# Altium project M8 Minima.PrjPcb (part 2 of 3)

## Sheet 04-2 m8 io 1.SchDoc
size A3; SheetNumber: 6; SheetTotal: 16
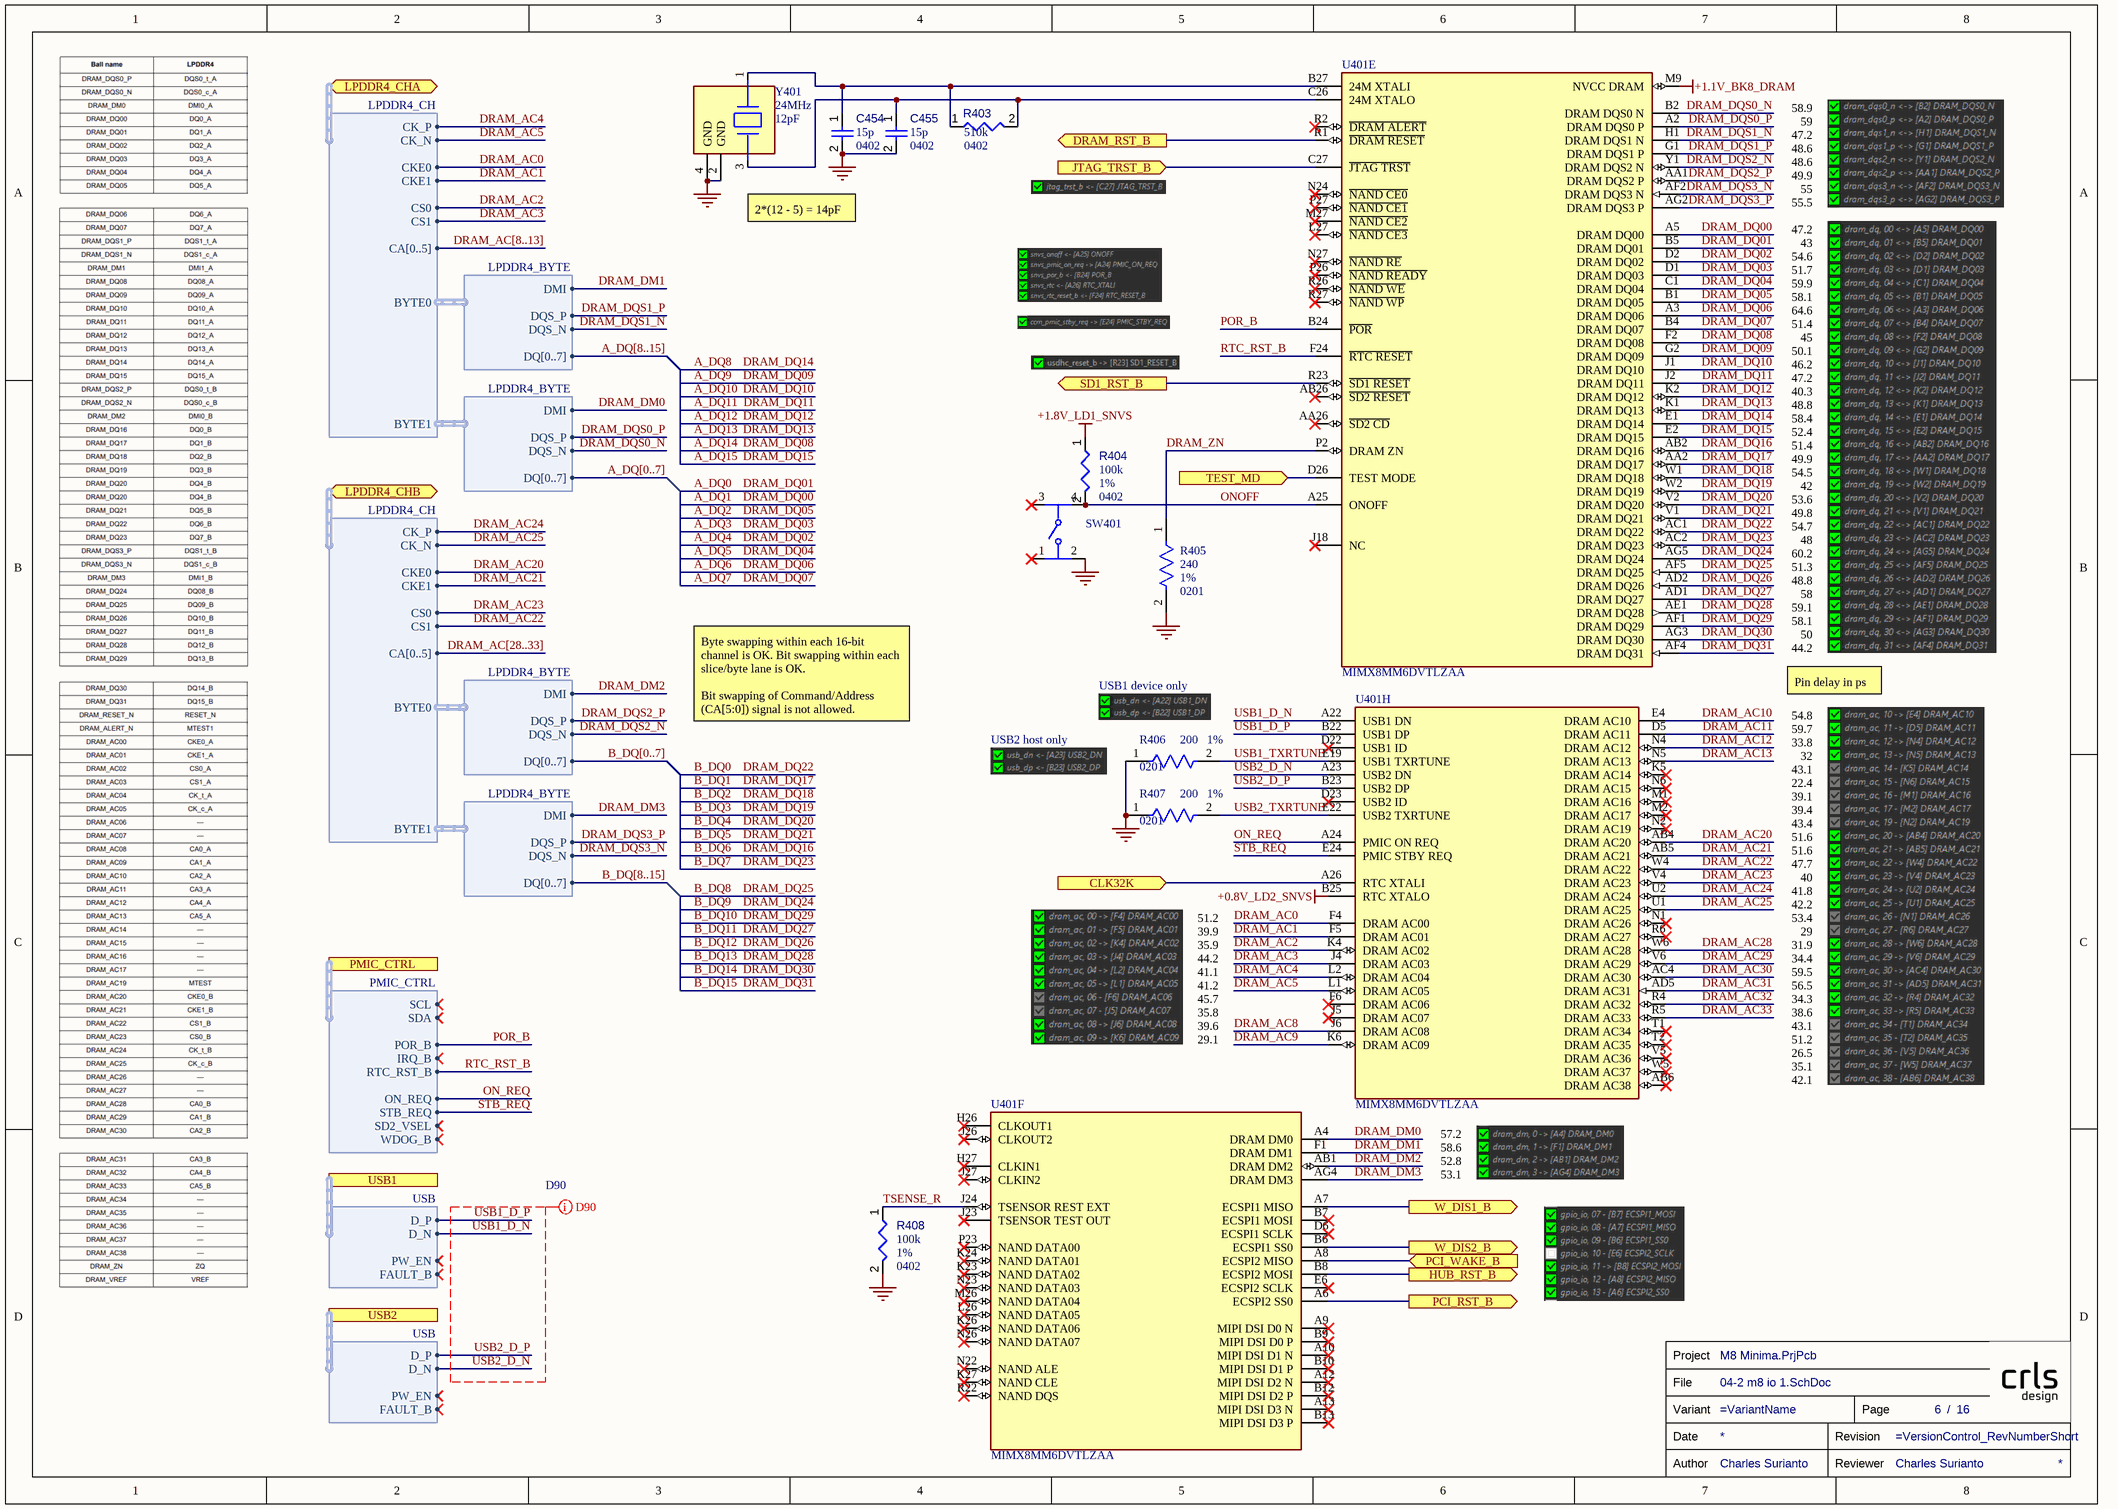
[diagram p4: 04-2 m8 io 1.SchDoc]

### Parts
(Parts that share a designator on the sheet are numbered #1, #2 ... from top to bottom, then left to right.)
C454  value 15p  Case/Package: 0402  [CAPC0402(1005)60_L]  (hidden comment: Capacitors,0402,15p)
C455  value 15p  Case/Package: 0402  [CAPC0402(1005)60_L]  (hidden comment: Capacitors,0402,15p)
R403  value 510k  Case/Package: 0402  [RESC0402(1005)_L]  (hidden comment: Resistors,0402,1%,510k)
R404  value 100k  Case/Package: 0402  Tolerance: 1%  [RESC0402(1005)_L]  (hidden comment: Resistors,0402,1%,100k)
R405  Tolerance: 1%  Case/Package: 0201  Resistance: 240  [FP-RMCF0201-MFG]  (hidden comment: RMCF0201FG240R)
R406  value 200  Tolerance: 1%  Case: 0201  [FP-ERJ1GN-MFG]  (hidden comment: ERJ-1GNF2000C)
R407  value 200  Tolerance: 1%  Case: 0201  [FP-ERJ1GN-MFG]  (hidden comment: ERJ-1GNF2000C)
R408  value 100k  Case/Package: 0402  Tolerance: 1%  [RESC0402(1005)_L]  (hidden comment: Resistors,0402,1%,100k)
SW401  PTS810SJM250SMTRLFS  [FP-PTS810SJM250SMTRLFS-MFG]  (value not drawn)
TB?#4  Reviewer: Charles Surianto  (hidden comment: TITLE_BLOCK)  (graphical)
U401  MIMX8MM6DVTLZAA  [FP-SOT1967-2-IPC_A]  (parts E,F,H of 11)
Y401  Load Capacitance: 12pF  Frequency: 24MHz  [FP-TSX-3225-MFG]  (hidden comment: TSX-3225 24.0000MF20G-AC3)

### Ports
CLK32K (in), DRAM_RST_B (out), HUB_RST_B (out), JTAG_TRST_B (in), LPDDR4_CHA (bidir, harness LPDDR4_CH), LPDDR4_CHB (bidir, harness LPDDR4_CH), PCI_RST_B (out), PCI_WAKE_B (in), PMIC_CTRL (harness PMIC_CTRL), SD1_RST_B (out), TEST_MD (in), USB1 (harness USB), USB2 (harness USB), W_DIS1_B (out), W_DIS2_B (out)

### Harnesses
LPDDR4_CH: CK_P, CK_N, CKE0, CKE1, CA[0..5], CS1, CS0, BYTE0, BYTE1
LPDDR4_BYTE: DMI, DQS_P, DQS_N, DQ[0..7]
PMIC_CTRL: SCL, SDA, IRQ_B, POR_B, RTC_RST_B, ON_REQ, STB_REQ, SD2_VSEL, WDOG_B
USB: PW_EN, FAULT_B, D_P, D_N

### Nets
+0.8V_LD2_SNVS: U401.B25(RTC_XTALO)
+1.1V_BK8_DRAM: U401.M9(NVCC_DRAM)
+1.8V_LD1_SNVS: R404.1
GND: C454.2 C455.2 R405.2 R406.1 R407.1 R408.2 SW401.2 Y401.2(GND) Y401.4(GND)
A_DQ0: U401.B5(DRAM_DQ01)  [also labelled DRAM_DQ01]
A_DQ1: U401.A5(DRAM_DQ00)  [also labelled DRAM_DQ00]
A_DQ2: U401.B1(DRAM_DQ05)  [also labelled DRAM_DQ05]
A_DQ3: U401.D1(DRAM_DQ03)  [also labelled DRAM_DQ03]
A_DQ4: U401.D2(DRAM_DQ02)  [also labelled DRAM_DQ02]
A_DQ5: U401.C1(DRAM_DQ04)  [also labelled DRAM_DQ04]
A_DQ6: U401.A3(DRAM_DQ06)  [also labelled DRAM_DQ06]
A_DQ7: U401.B4(DRAM_DQ07)  [also labelled DRAM_DQ07]
A_DQ8: U401.E1(DRAM_DQ14)  [also labelled DRAM_DQ14]
A_DQ9: U401.G2(DRAM_DQ09)  [also labelled DRAM_DQ09]
A_DQ10: U401.J1(DRAM_DQ10)  [also labelled DRAM_DQ10]
A_DQ11: U401.J2(DRAM_DQ11)  [also labelled DRAM_DQ11]
A_DQ12: U401.K2(DRAM_DQ12)  [also labelled DRAM_DQ12]
A_DQ13: U401.K1(DRAM_DQ13)  [also labelled DRAM_DQ13]
A_DQ14: U401.F2(DRAM_DQ08)  [also labelled DRAM_DQ08]
A_DQ15: U401.E2(DRAM_DQ15)  [also labelled DRAM_DQ15]
B_DQ0: U401.AC1(DRAM_DQ22)  [also labelled DRAM_DQ22]  [project net A_DQ0]
B_DQ1: U401.AA2(DRAM_DQ17)  [also labelled DRAM_DQ17]  [project net A_DQ1]
B_DQ2: U401.W1(DRAM_DQ18)  [also labelled DRAM_DQ18]  [project net A_DQ2]
B_DQ3: U401.W2(DRAM_DQ19)  [also labelled DRAM_DQ19]  [project net A_DQ3]
B_DQ4: U401.V2(DRAM_DQ20)  [also labelled DRAM_DQ20]  [project net A_DQ4]
B_DQ5: U401.V1(DRAM_DQ21)  [also labelled DRAM_DQ21]  [project net A_DQ5]
B_DQ6: U401.AB2(DRAM_DQ16)  [also labelled DRAM_DQ16]  [project net A_DQ6]
B_DQ7: U401.AC2(DRAM_DQ23)  [also labelled DRAM_DQ23]  [project net A_DQ7]
B_DQ8: U401.AF5(DRAM_DQ25)  [also labelled DRAM_DQ25]  [project net A_DQ8]
B_DQ9: U401.AG5(DRAM_DQ24)  [also labelled DRAM_DQ24]  [project net A_DQ9]
B_DQ10: U401.AF1(DRAM_DQ29)  [also labelled DRAM_DQ29]  [project net A_DQ10]
B_DQ11: U401.AD1(DRAM_DQ27)  [also labelled DRAM_DQ27]  [project net A_DQ11]
B_DQ12: U401.AD2(DRAM_DQ26)  [also labelled DRAM_DQ26]  [project net A_DQ12]
B_DQ13: U401.AE1(DRAM_DQ28)  [also labelled DRAM_DQ28]  [project net A_DQ13]
B_DQ14: U401.AG3(DRAM_DQ30)  [also labelled DRAM_DQ30]  [project net A_DQ14]
B_DQ15: U401.AF4(DRAM_DQ31)  [also labelled DRAM_DQ31]  [project net A_DQ15]
DRAM_AC0: U401.F4(DRAM_AC00) ; port LPDDR4_CHA.CKE0  [project net DRAM_CHA.CKE0]
DRAM_AC1: U401.F5(DRAM_AC01) ; port LPDDR4_CHA.CKE1  [project net DRAM_CHA.CKE1]
DRAM_AC2: U401.K4(DRAM_AC02) ; port LPDDR4_CHA.CS0  [project net DRAM_CHA.CS0]
DRAM_AC3: U401.J4(DRAM_AC03) ; port LPDDR4_CHA.CS1  [project net DRAM_CHA.CS1]
DRAM_AC4: U401.L2(DRAM_AC04) ; port LPDDR4_CHA.CK_P  [project net DRAM_CHA.CK_P]
DRAM_AC5: U401.L1(DRAM_AC05) ; port LPDDR4_CHA.CK_N  [project net DRAM_CHA.CK_N]
DRAM_AC8: U401.J6(DRAM_AC08)  [project net B_CA0]
DRAM_AC9: U401.K6(DRAM_AC09)  [project net B_CA1]
DRAM_AC10: U401.E4(DRAM_AC10)  [project net B_CA2]
DRAM_AC11: U401.D5(DRAM_AC11)  [project net B_CA3]
DRAM_AC12: U401.N4(DRAM_AC12)  [project net B_CA4]
DRAM_AC13: U401.N5(DRAM_AC13)  [project net B_CA5]
DRAM_AC20: U401.AB4(DRAM_AC20) ; port LPDDR4_CHB.CKE0  [project net DRAM_CHB.CKE0]
DRAM_AC21: U401.AB5(DRAM_AC21) ; port LPDDR4_CHB.CKE1  [project net DRAM_CHB.CKE1]
DRAM_AC22: U401.W4(DRAM_AC22) ; port LPDDR4_CHB.CS1  [project net DRAM_CHB.CS1]
DRAM_AC23: U401.V4(DRAM_AC23) ; port LPDDR4_CHB.CS0  [project net DRAM_CHB.CS0]
DRAM_AC24: U401.U2(DRAM_AC24) ; port LPDDR4_CHB.CK_P  [project net DRAM_CHB.CK_P]
DRAM_AC25: U401.U1(DRAM_AC25) ; port LPDDR4_CHB.CK_N  [project net DRAM_CHB.CK_N]
DRAM_AC28: U401.W6(DRAM_AC28)  [project net A_CA0]
DRAM_AC29: U401.V6(DRAM_AC29)  [project net A_CA1]
DRAM_AC30: U401.AC4(DRAM_AC30)  [project net A_CA2]
DRAM_AC31: U401.AD5(DRAM_AC31)  [project net A_CA3]
DRAM_AC32: U401.R4(DRAM_AC32)  [project net A_CA4]
DRAM_AC33: U401.R5(DRAM_AC33)  [project net A_CA5]
DRAM_DM0: U401.A4(DRAM_DM0) ; harness LPDDR4_BYTE.DMI  [project net B_DMI1]
DRAM_DM1: U401.F1(DRAM_DM1) ; harness LPDDR4_BYTE.DMI  [project net B_DMI0]
DRAM_DM2: U401.AB1(DRAM_DM2) ; harness LPDDR4_BYTE.DMI  [project net A_DMI0]
DRAM_DM3: U401.AG4(DRAM_DM3) ; harness LPDDR4_BYTE.DMI  [project net A_DMI1]
DRAM_DQS0_N: U401.B2(DRAM_DQS0_N) ; harness LPDDR4_BYTE.DQS_N  [project net B_DQS1_N]
DRAM_DQS0_P: U401.A2(DRAM_DQS0_P) ; harness LPDDR4_BYTE.DQS_P  [project net B_DQS1_P]
DRAM_DQS1_N: U401.H1(DRAM_DQS1_N) ; harness LPDDR4_BYTE.DQS_N  [project net B_DQS0_N]
DRAM_DQS1_P: U401.G1(DRAM_DQS1_P) ; harness LPDDR4_BYTE.DQS_P  [project net B_DQS0_P]
DRAM_DQS2_N: U401.Y1(DRAM_DQS2_N) ; harness LPDDR4_BYTE.DQS_N  [project net A_DQS0_N]
DRAM_DQS2_P: U401.AA1(DRAM_DQS2_P) ; harness LPDDR4_BYTE.DQS_P  [project net A_DQS0_P]
DRAM_DQS3_N: U401.AF2(DRAM_DQS3_N) ; harness LPDDR4_BYTE.DQS_N  [project net A_DQS1_N]
DRAM_DQS3_P: U401.AG2(DRAM_DQS3_P) ; harness LPDDR4_BYTE.DQS_P  [project net A_DQS1_P]
DRAM_RST_B: U401.R1(~{DRAM_RESET}) ; port DRAM_RST_B
DRAM_ZN: R405.1 U401.P2(DRAM_ZN)
HUB_RST_B: U401.B8(ECSPI2_MOSI) ; port HUB_RST_B
JTAG_TRST_B: U401.C27(~{JTAG_TRST}) ; port JTAG_TRST_B
ON_REQ: U401.A24(PMIC_ON_REQ) ; port PMIC_CTRL.ON_REQ  [project net PMIC_CTRL.ON_REQ]
ONOFF: R404.2 SW401.4 U401.A25(ONOFF)
PCI_RST_B: U401.A6(ECSPI2_SS0) ; port PCI_RST_B
PCI_WAKE_B: U401.A8(ECSPI2_MISO) ; port PCI_WAKE_B
PMIC_CLK32K: U401.A26(RTC_XTALI) ; port CLK32K
POR_B: U401.B24(~{POR}) ; port PMIC_CTRL.POR_B  [project net PMIC_CTRL.POR_B]
RTC_RST_B: U401.F24(~{RTC_RESET}) ; port PMIC_CTRL.RTC_RST_B  [project net PMIC_CTRL.RTC_RST_B]
SD1_RST_B: U401.R23(~{SD1_RESET}) ; port SD1_RST_B
STB_REQ: U401.E24(PMIC_STBY_REQ) ; port PMIC_CTRL.STB_REQ  [project net PMIC_CTRL.STB_REQ]
TEST_MD: U401.D26(TEST_MODE) ; port TEST_MD
TSENSE_R: R408.1 U401.J24(TSENSOR_REST_EXT)
USB1_D_N: U401.A22(USB1_DN) ; port USB1.D_N  [project net USB1.D_N]
USB1_D_P: U401.B22(USB1_DP) ; port USB1.D_P  [project net USB1.D_P]
USB1_TXRTUNE: R406.2 U401.E19(USB1_TXRTUNE)
USB2_D_N: U401.A23(USB2_DN) ; port USB2.D_N  [project net USB2.D_N]
USB2_D_P: U401.B23(USB2_DP) ; port USB2.D_P  [project net USB2.D_P]
USB2_TXRTUNE: R407.2 U401.E22(USB2_TXRTUNE)
W_DIS1_B: U401.A7(ECSPI1_MISO) ; port W_DIS1_B
W_DIS2_B: U401.B6(ECSPI1_SS0) ; port W_DIS2_B
NetC454_1: C454.1 R403.1 U401.B27(24M_XTALI) Y401.1
NetC455_1: C455.1 R403.2 U401.C26(24M_XTALO) Y401.3

Not connected (* = marked no-connect by the designer): SW401 1* 3*; U401 A9(MIPI_DSI_D0_N)* A10(MIPI_DSI_D1_N)* A12(MIPI_DSI_D2_N)* A13(MIPI_DSI_D3_N)* AA26(~{SD2_CD})* AB6(DRAM_AC38)* AB26(~{SD2_RESET})* B7(ECSPI1_MOSI)* B9(MIPI_DSI_D0_P)* B10(MIPI_DSI_D1_P)* B12(MIPI_DSI_D2_P)* B13(MIPI_DSI_D3_P)* D6(ECSPI1_SCLK)* D22(USB1_ID)* D23(USB2_ID)* E6(ECSPI2_SCLK)* F6(DRAM_AC06)* H26(CLKOUT1)* H27(CLKIN1)* J5(DRAM_AC07)* J18(NC)* J23(TSENSOR_TEST_OUT)* J26(CLKOUT2)* J27(CLKIN2)* K5(DRAM_AC14)* K23(NAND_DATA02)* K24(NAND_DATA01)* K26(NAND_DATA06)* K27(NAND_CLE)* L26(NAND_DATA05)* L27(~{NAND_CE3})* M1(DRAM_AC16)* M2(DRAM_AC17)* M26(NAND_DATA04)* M27(~{NAND_CE2})* N1(DRAM_AC26)* N2(DRAM_AC19)* N6(DRAM_AC15)* N22(NAND_ALE)* N23(NAND_DATA03)* N24(~{NAND_CE0})* N26(NAND_DATA07)* N27(~{NAND_RE})* P23(NAND_DATA00)* P26(~{NAND_READY})* P27(~{NAND_CE1})* R2(~{DRAM_ALERT})* R6(DRAM_AC27)* R22(NAND_DQS)* R26(~{NAND_WE})* R27(~{NAND_WP})* T1(DRAM_AC34)* T2(DRAM_AC35)* V5(DRAM_AC36)* W5(DRAM_AC37)*

### Buses and harness runs
bus A_DQ[0..7]
bus A_DQ[8..15]
bus B_DQ[0..7]
bus B_DQ[8..15]
bus DRAM_AC[8..13]
bus DRAM_AC[28..33]

### Layout directives
differential pair; differential pair class D90: USB1_D_N, USB1_D_P, USB2_D_N, USB2_D_P

### Notes on the sheet
- 2*(12 - 5) = 14pF
- 58.9
  59
  47.2
  48.6
  48.6
  49.9
  55
  55.5
- 47.2
  43
  54.6
  51.7
  59.9
  58.1
  64.6
  51.4
  45
  50.1
  46.2
  47.2
  40.3
  48.8
  58.4
  52.4
  51.4
  49.9
  54.5
  42
  53.6
  49.8
  54.7
  48
  60.2
  51.3
  48.8
  58
  59.1
  58.1
  50
  44.2
- Byte swapping within each 16-bit channel is OK. Bit swapping within each slice/byte lane is OK.
  Bit swapping of Command/Address (CA[5:0]) signal is not allowed.
- USB1 device only
- Pin delay in ps
- USB2 host only
- 51.2
  39.9
  35.9
  44.2
  41.1
  41.2
  45.7
  35.8
  39.6
  29.1
- 54.8
  59.7
  33.8
  32
  43.1
  22.4
  39.1
  39.4
  43.4
  51.6
  51.6
  47.7
  40
  41.8
  42.2
  53.4
  29
  31.9
  34.4
  59.5
  56.5
  34.3
  38.6
  43.1
  51.2
  26.5
  35.1
  42.1
- (near U401) 57.2
  58.6
  52.8
  53.1
- (in symbol TITLE_BLOCK) Project; File; Variant; Page; /; Date; Revision; Author; Reviewer

### Library data of the parts
C454 C455 = Capacitors: Capacitor; Component Type: Capacitors
R403 R404 R408 = Resistors: Resistor; Component Type: Resistors
  R403: Tolerance: 1%
R405 = CMP-26527-006303-1: 240Ω ±1% 0.05W 0201 Thick Film Chip Resistor AEC-Q200 compliant; Temperature Coefficient: 200ppm/°C; Max Power Dissipation: 50mW; Resistor Type: Thick Film; Case Code (Imperial): 0201; Case Code (Metric): 0603; Min Operating Temperature: -55°C; Length: 0.024inch; Packaging: Tape and Reel; Max Operating Temperature: 125°C; Number of Terminations: 2; Width: 0.012inch; Height: 0.009inch
R406 R407 = CMP-2004-03479-2: RES SMD 200 OHM 1% 1/20W 0201; Manufacturer: Panasonic Electronic Components; Power Rating: 0.05W; Automotive Grade: Grade 1; Temperature Coefficient: 200ppm/°C; Resistance: 200Ω; Voltage Rating: 25V; Height: 0.26mm; Mouser Description: Thick Film Resistors - SMD 0201 200ohm 1% HalogenFree AEC-Q200; Composition: Thick Film; Footprint Url: https://industrial.panasonic.com/cdbs/www-data/pdf/RDA0000/DMA0000COL17.pdf; Manufacturer Part Number: ERJ-1GNF2000C; Temperature Range High: +125°C; Automotive: Yes; Package: ERJ1GN; Octopart: https://octopart.com/erj-1gnf2000c-panasonic-55419768; Device Class L3: Chip SMD Resistors; Category: Res; ComponentLink2URL: https://industrial.panasonic.com/cdbs/www-data/pdf/RDA0000/AOA0000C304.pdf; Digikey Description: RES SMD 200 OHM 1% 1/20W 0201; Temperature: -55°C to +125°C; Temperature Range Low: -55°C; ComponentLink2Description: Datasheet; Series: ERJ; RoHS: TRUE; Lead Free: Yes; Device Class L2: Resistors; Device Class L1: Passive Components
SW401 = CMP-10040-000001-2: SWITCH TACTILE SPST-NO 0.05A 16V; Throw Configuration: SPST; Operating Force: 160gf; Actuator Type: Standard; Switch Travel: 0.15mm; Switch Function: Off-Mom; Max Current Rating: 50mA; Mechanical Life: 150000Cycles; Illumination Type: Non-Illuminated; Package Quantity: 2900; Depth: 4.6mm; Mount: Surface Mount; Packaging: Tape and Reel; Length: 3.2mm; RoHS Compliant: Yes; Case/Package: SMD/SMT; Voltage Rating (DC): 16V; Min Operating Temperature: -40°C; Termination: J-Bend; Lead Free: Lead Free; Contact Plating: Silver; Orientation: Straight; Max Operating Temperature: 85°C; Current Rating: 50mA; Color: Black
U401 = CMP-10096-000012-1: IC MPU I.MX 8M MINI QUAD BGA; RoHS Compliant: Yes
Y401 = CMP-36405-000018-1: CRYSTAL 24.0000MHZ 9PF SMD; ESR (Equivalent Series Resistance): 40R; Frequency Stability: 20ppm; Tolerance: 10ppm; Drive Level: 200uW; Min Operating Temperature: -40°C; RoHS Compliant: Yes; Width: 2.5mm; Max Operating Temperature: 105°C; Package Quantity: 250; Mount: Surface Mount; Lead Free: Lead Free; Height: 0.024inch; Depth: 2.5mm; Packaging: Tape and Reel; Series: TSX-3225; Weight: 0.000564oz; Number of Pins: 4; Termination: SMD/SMT; Case/Package: SMD/SMT; Length: 3.2mm; Frequency Tolerance: 10ppm
TB?#4 = TITLE_BLOCK: Review Date: *

## Sheet 04-4 m8 boot config.SchDoc
size A3; SheetNumber: 8; SheetTotal: 16
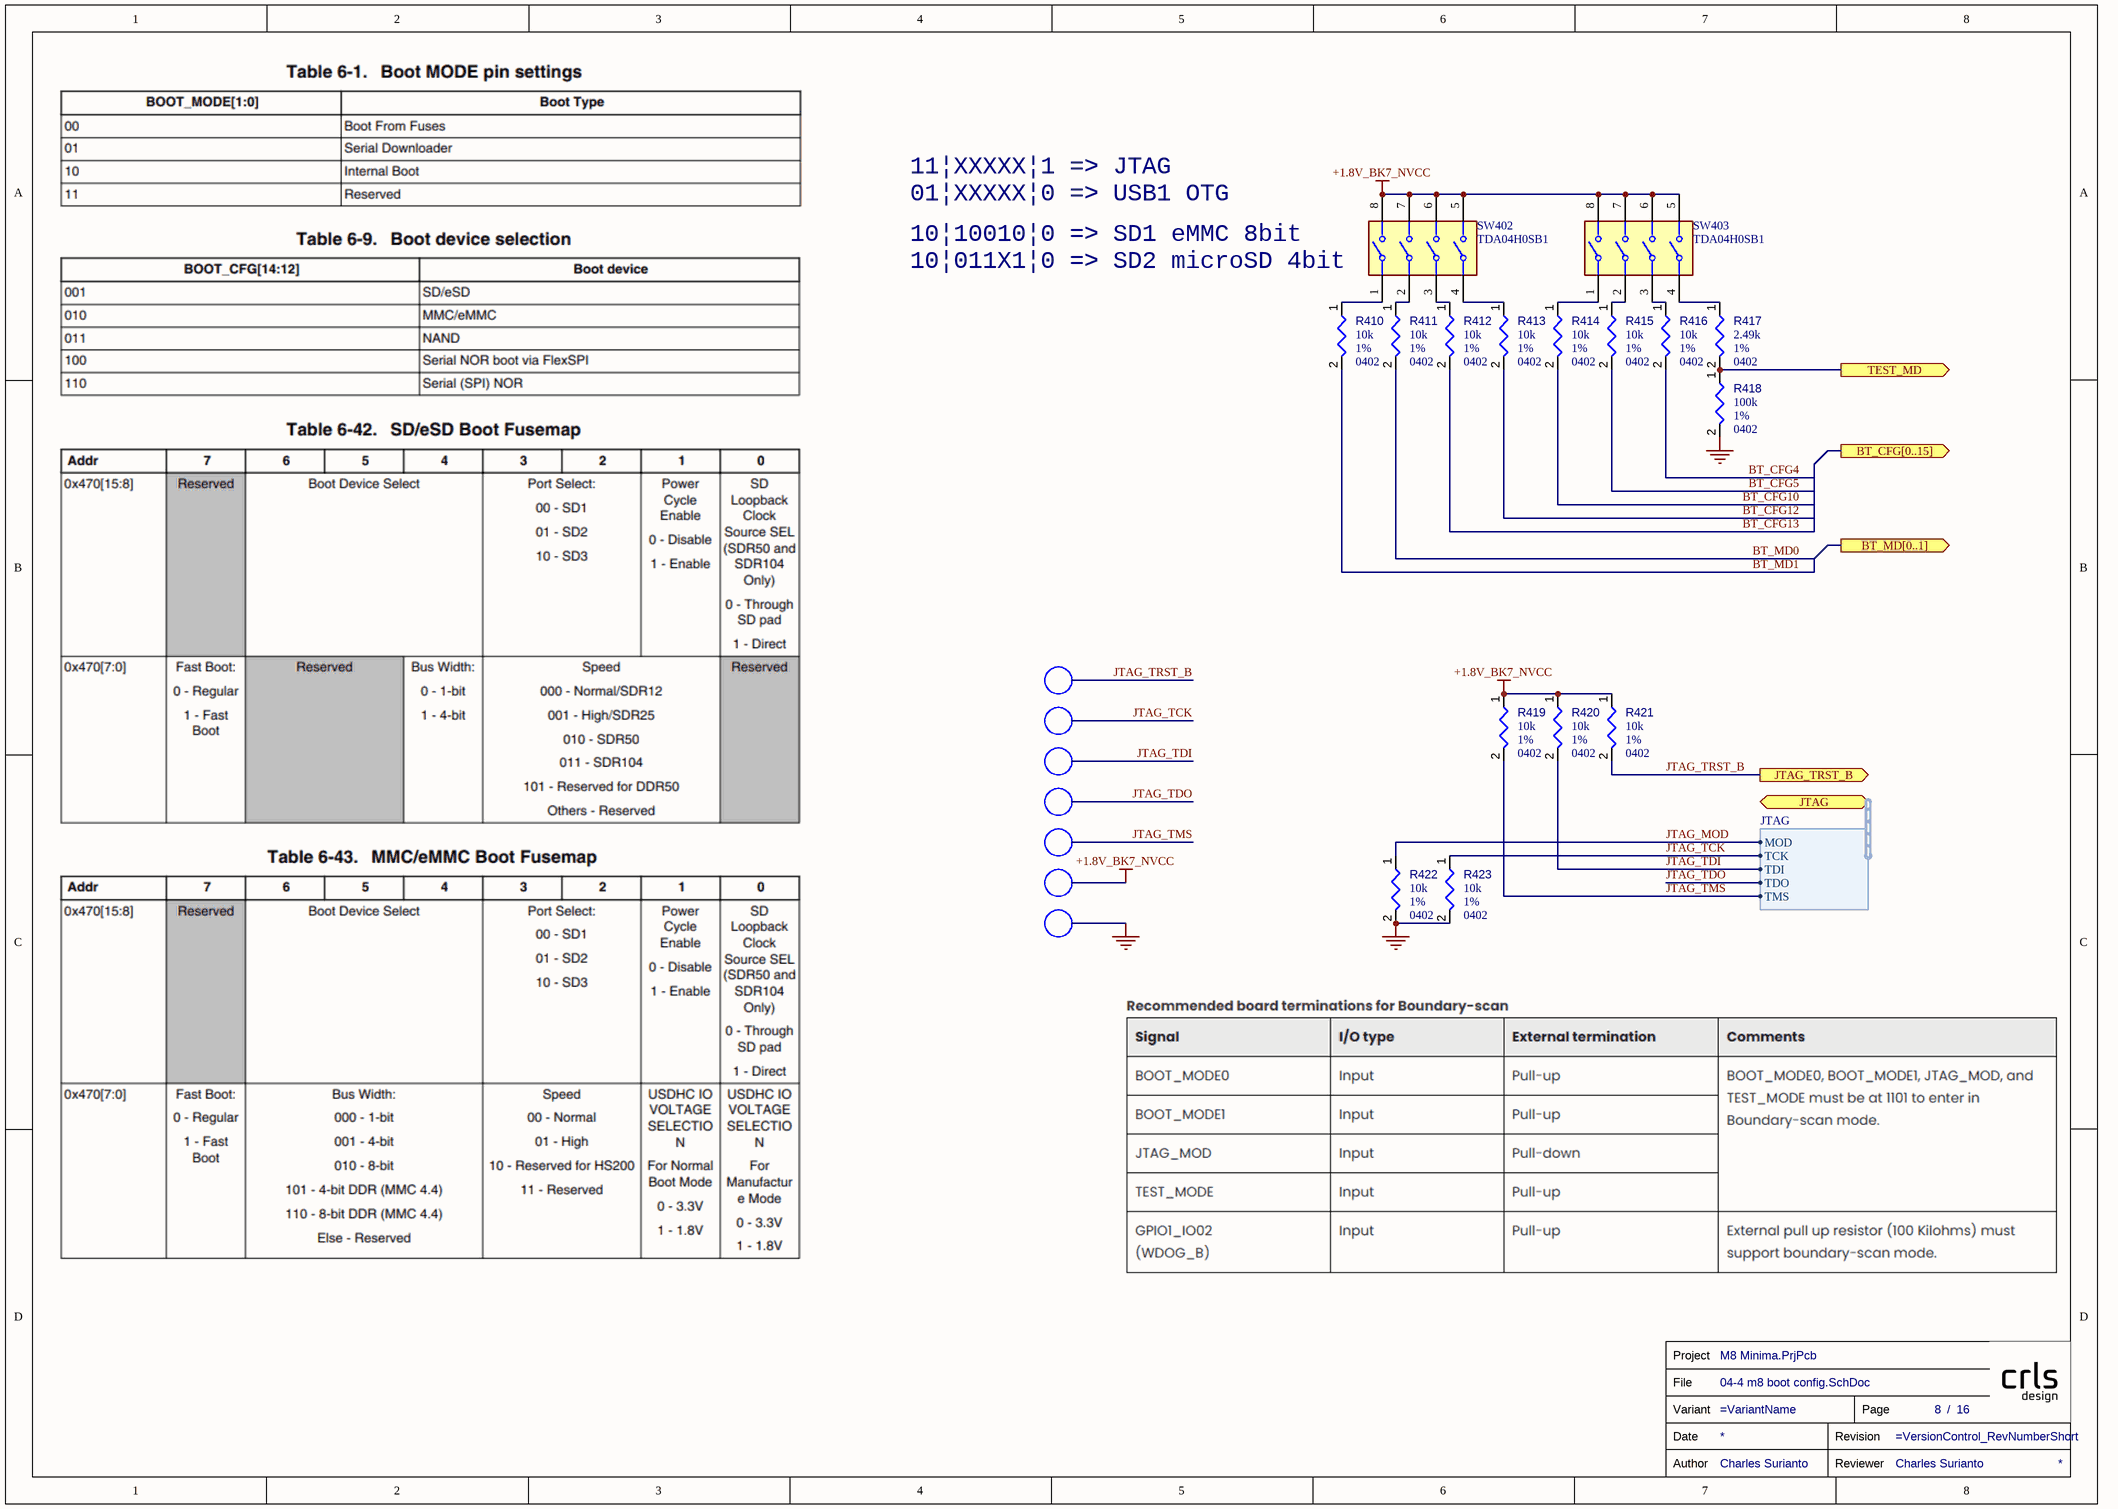
[diagram p5: 04-4 m8 boot config.SchDoc]

### Parts
(Parts that share a designator on the sheet are numbered #1, #2 ... from top to bottom, then left to right.)
R410  value 10k  Case/Package: 0402  Tolerance: 1%  [RESC0402(1005)_L]  (hidden comment: Resistors,0402,1%,10k)
R411  value 10k  Case/Package: 0402  Tolerance: 1%  [RESC0402(1005)_L]  (hidden comment: Resistors,0402,1%,10k)
R412  value 10k  Case/Package: 0402  Tolerance: 1%  [RESC0402(1005)_L]  (hidden comment: Resistors,0402,1%,10k)
R413  value 10k  Case/Package: 0402  Tolerance: 1%  [RESC0402(1005)_L]  (hidden comment: Resistors,0402,1%,10k)
R414  value 10k  Case/Package: 0402  Tolerance: 1%  [RESC0402(1005)_L]  (hidden comment: Resistors,0402,1%,10k)
R415  value 10k  Case/Package: 0402  Tolerance: 1%  [RESC0402(1005)_L]  (hidden comment: Resistors,0402,1%,10k)
R416  value 10k  Case/Package: 0402  Tolerance: 1%  [RESC0402(1005)_L]  (hidden comment: Resistors,0402,1%,10k)
R417  value 2.49k  Case/Package: 0402  Tolerance: 1%  [RESC0402(1005)_L]  (hidden comment: Resistors,0402,1%,2.49k)
R418  value 100k  Case/Package: 0402  Tolerance: 1%  [RESC0402(1005)_L]  (hidden comment: Resistors,0402,1%,100k)
R419  value 10k  Case/Package: 0402  Tolerance: 1%  [RESC0402(1005)_L]  (hidden comment: Resistors,0402,1%,10k)
R420  value 10k  Case/Package: 0402  Tolerance: 1%  [RESC0402(1005)_L]  (hidden comment: Resistors,0402,1%,10k)
R421  value 10k  Case/Package: 0402  Tolerance: 1%  [RESC0402(1005)_L]  (hidden comment: Resistors,0402,1%,10k)
R422  value 10k  Case/Package: 0402  Tolerance: 1%  [RESC0402(1005)_L]  (hidden comment: Resistors,0402,1%,10k)
R423  value 10k  Case/Package: 0402  Tolerance: 1%  [RESC0402(1005)_L]  (hidden comment: Resistors,0402,1%,10k)
SW402  TDA04H0SB1  [FP-TDA04H0SB1-MFG]
SW403  TDA04H0SB1  [FP-TDA04H0SB1-MFG]
TB?#5  Reviewer: Charles Surianto  (hidden comment: TITLE_BLOCK)  (graphical)

### Ports
BT_CFG[0..15] (out), BT_MD[0..1] (out), JTAG (bidir, harness JTAG), JTAG_TRST_B (out), TEST_MD (out)

### Harnesses
JTAG: MOD, TCK, TDI, TDO, TMS

### Nets
+1.8V_BK7_NVCC: R419.1 R420.1 R421.1 SW402.5 SW402.6 SW402.7 SW402.8 SW403.5 SW403.6 SW403.7 SW403.8
GND: R418.2 R422.2 R423.2
BT_CFG4: R416.2
BT_CFG5: R415.2
BT_CFG10: R414.2
BT_CFG12: R413.2
BT_CFG13: R412.2
BT_MD0: R411.2
BT_MD1: R410.2
JTAG_MOD: R422.1 ; port JTAG.MOD
JTAG_TCK: R423.1 ; port JTAG.TCK
JTAG_TDI: R420.2 ; port JTAG.TDI
JTAG_TMS: R419.2 ; port JTAG.TMS
JTAG_TRST_B: R421.2 ; port JTAG_TRST_B
TEST_MD: R417.2 R418.1 ; port TEST_MD
NetR410_1: R410.1 SW402.1
NetR411_1: R411.1 SW402.2
NetR412_1: R412.1 SW402.3
NetR413_1: R413.1 SW402.4
NetR414_1: R414.1 SW403.1
NetR415_1: R415.1 SW403.2
NetR416_1: R416.1 SW403.3
NetR417_1: R417.1 SW403.4

### Notes on the sheet
- 11|XXXXX|1 => JTAG
- 01|XXXXX|0 => USB1 OTG
- 10|10010|0 => SD1 eMMC 8bit
- 10|011X1|0 => SD2 microSD 4bit
- (in symbol TITLE_BLOCK) Project; File; Variant; Page; /; Date; Revision; Author; Reviewer

### Library data of the parts
R410-R423 = Resistors: Resistor; Component Type: Resistors
SW402 SW403 = CMP-10033-000006-1: SWITCH SLIDE DIP SPST 25MA 24V; Number of Switches: 4; Body Material: Polyphenylene; Pitch: 0.05inch; Washable: Yes; Lead/Base Style: Gull Wing; Electrical Life: 1000Cycles; Actuator Material: Polymer; Actuator Type: Slide (Standard); Contact Resistance: 100mR; Actuator Length: 0mm; Current Rating: 100mA; Number of Positions: 4; Reach SVHC Compliant: Yes; Throw Configuration: SPST; Orientation: Straight; Lead Free: Lead Free; Max Current Rating: 25mA; Length: 6.21mm; Packaging: Rail/Tube; Terminal Pitch: 1.27mm; Max Voltage Rating (DC): 24V; Case/Package: DIP; Depth: 8.12mm; Termination: Gull Wing; Contact Plating: Gold; Contact Material: Copper Alloy; Contact Current Rating: 25mA; Voltage Rating (DC): 24V; Max Operating Temperature: 85°C; Package Quantity: 70; Mount: Surface Mount; RoHS Compliant: Yes; Mechanical Life: 1000Cycles; Radiation Hardening: No; Series: TDA; Min Operating Temperature: -40°C
TB?#5 = TITLE_BLOCK: Review Date: *

## Sheet 05 lpddr4 ram.SchDoc
size A3; SheetNumber: 9; SheetTotal: 16
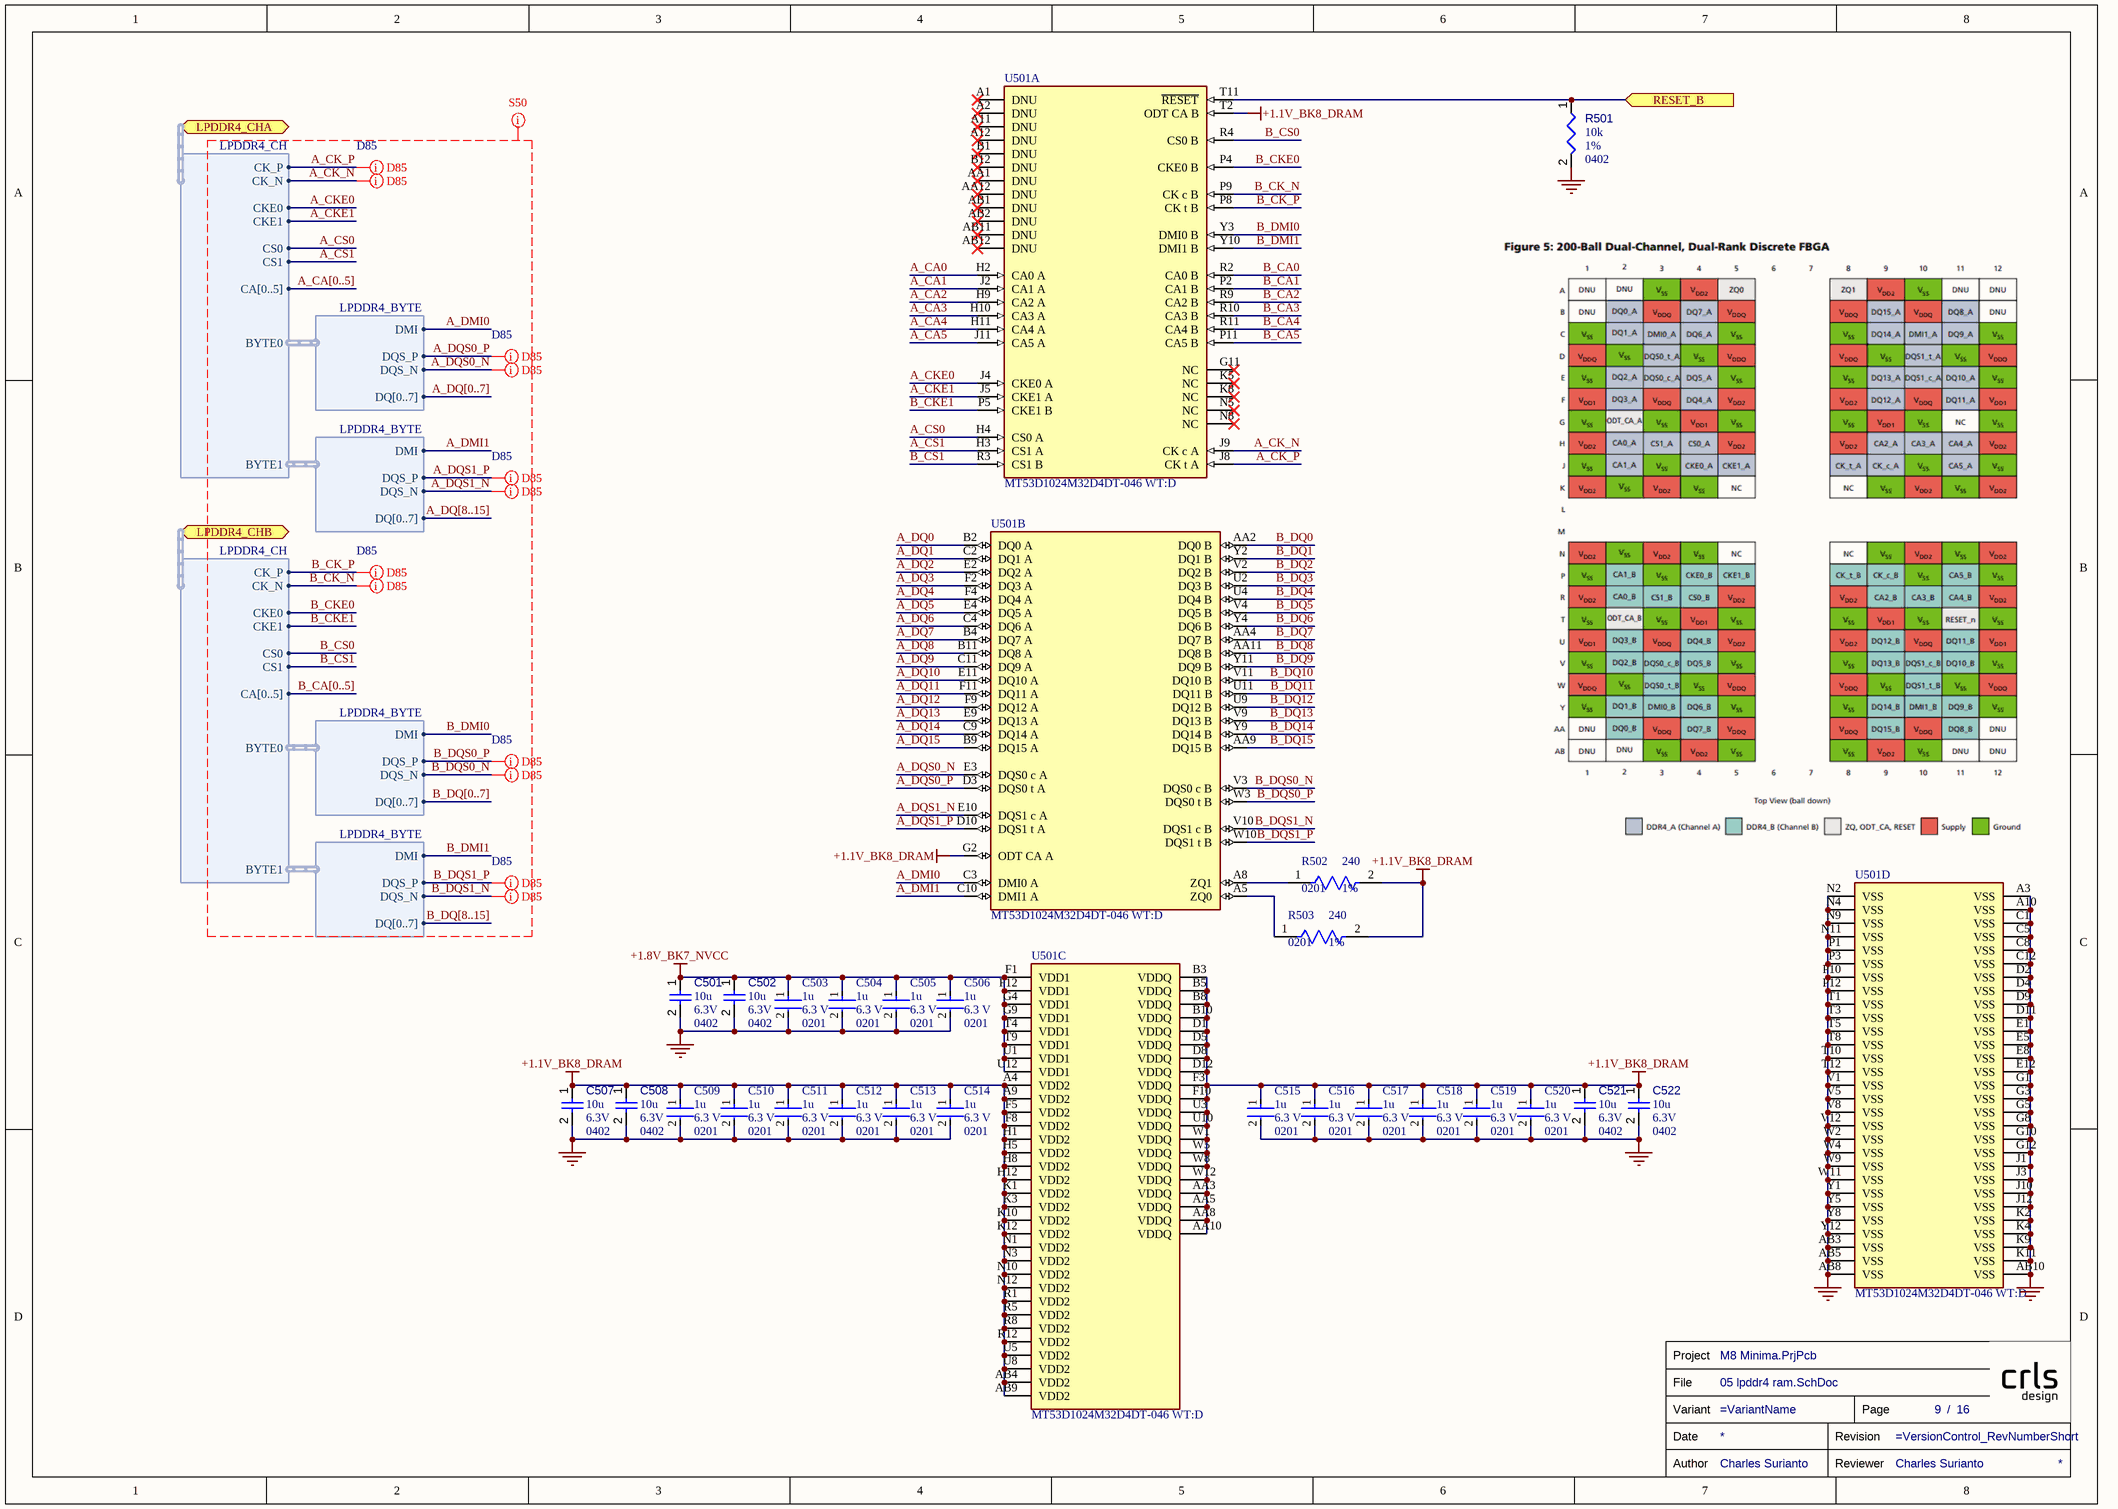
[diagram p6: 05 lpddr4 ram.SchDoc]

### Parts
(Parts that share a designator on the sheet are numbered #1, #2 ... from top to bottom, then left to right.)
C501  value 10u  Case/Package: 0402  Voltage Rating: 6.3V  [CAPC0402(1005)60_L]  (hidden comment: Capacitors,0402,10u,6.3V)
C502  value 10u  Case/Package: 0402  Voltage Rating: 6.3V  [CAPC0402(1005)60_L]  (hidden comment: Capacitors,0402,10u,6.3V)
C503  Package: 0201  Capacitance: 1u  Voltage Rating: 6.3 V  [FP-CC0201-BA-MFG]  (hidden comment: CC0201MRX5R5BB105)
C504  Package: 0201  Capacitance: 1u  Voltage Rating: 6.3 V  [FP-CC0201-BA-MFG]  (hidden comment: CC0201MRX5R5BB105)
C505  Package: 0201  Capacitance: 1u  Voltage Rating: 6.3 V  [FP-CC0201-BA-MFG]  (hidden comment: CC0201MRX5R5BB105)
C506  Package: 0201  Capacitance: 1u  Voltage Rating: 6.3 V  [FP-CC0201-BA-MFG]  (hidden comment: CC0201MRX5R5BB105)
C507  value 10u  Case/Package: 0402  Voltage Rating: 6.3V  [CAPC0402(1005)60_L]  (hidden comment: Capacitors,0402,10u,6.3V)
C508  value 10u  Case/Package: 0402  Voltage Rating: 6.3V  [CAPC0402(1005)60_L]  (hidden comment: Capacitors,0402,10u,6.3V)
C509  Package: 0201  Capacitance: 1u  Voltage Rating: 6.3 V  [FP-CC0201-BA-MFG]  (hidden comment: CC0201MRX5R5BB105)
C510  Package: 0201  Capacitance: 1u  Voltage Rating: 6.3 V  [FP-CC0201-BA-MFG]  (hidden comment: CC0201MRX5R5BB105)
C511  Package: 0201  Capacitance: 1u  Voltage Rating: 6.3 V  [FP-CC0201-BA-MFG]  (hidden comment: CC0201MRX5R5BB105)
C512  Package: 0201  Capacitance: 1u  Voltage Rating: 6.3 V  [FP-CC0201-BA-MFG]  (hidden comment: CC0201MRX5R5BB105)
C513  Package: 0201  Capacitance: 1u  Voltage Rating: 6.3 V  [FP-CC0201-BA-MFG]  (hidden comment: CC0201MRX5R5BB105)
C514  Package: 0201  Capacitance: 1u  Voltage Rating: 6.3 V  [FP-CC0201-BA-MFG]  (hidden comment: CC0201MRX5R5BB105)
C515  Package: 0201  Capacitance: 1u  Voltage Rating: 6.3 V  [FP-CC0201-BA-MFG]  (hidden comment: CC0201MRX5R5BB105)
C516  Package: 0201  Capacitance: 1u  Voltage Rating: 6.3 V  [FP-CC0201-BA-MFG]  (hidden comment: CC0201MRX5R5BB105)
C517  Package: 0201  Capacitance: 1u  Voltage Rating: 6.3 V  [FP-CC0201-BA-MFG]  (hidden comment: CC0201MRX5R5BB105)
C518  Package: 0201  Capacitance: 1u  Voltage Rating: 6.3 V  [FP-CC0201-BA-MFG]  (hidden comment: CC0201MRX5R5BB105)
C519  Package: 0201  Capacitance: 1u  Voltage Rating: 6.3 V  [FP-CC0201-BA-MFG]  (hidden comment: CC0201MRX5R5BB105)
C520  Package: 0201  Capacitance: 1u  Voltage Rating: 6.3 V  [FP-CC0201-BA-MFG]  (hidden comment: CC0201MRX5R5BB105)
C521  value 10u  Case/Package: 0402  Voltage Rating: 6.3V  [CAPC0402(1005)60_L]  (hidden comment: Capacitors,0402,10u,6.3V)
C522  value 10u  Case/Package: 0402  Voltage Rating: 6.3V  [CAPC0402(1005)60_L]  (hidden comment: Capacitors,0402,10u,6.3V)
R501  value 10k  Case/Package: 0402  Tolerance: 1%  [RESC0402(1005)_L]  (hidden comment: Resistors,0402,1%,10k)
R502  Tolerance: 1%  Case/Package: 0201  Resistance: 240  [FP-RMCF0201-MFG]  (hidden comment: RMCF0201FG240R)
R503  Tolerance: 1%  Case/Package: 0201  Resistance: 240  [FP-RMCF0201-MFG]  (hidden comment: RMCF0201FG240R)
TB?#6  Reviewer: Charles Surianto  (hidden comment: TITLE_BLOCK)  (graphical)
U501  MT53D1024M32D4DT-046 WT:D  [FP-DT-IPC_C]  (parts A,B,C,D of 4)

### Ports
LPDDR4_CHA (bidir, harness LPDDR4_CH), LPDDR4_CHB (bidir, harness LPDDR4_CH), RESET_B (in)

### Harnesses
LPDDR4_CH: CK_P, CK_N, CKE0, CKE1, CA[0..5], CS1, CS0, BYTE0, BYTE1
LPDDR4_BYTE: DMI, DQS_P, DQS_N, DQ[0..7]

### Nets
+1.1V_BK8_DRAM: C507.1 C508.1 C509.1 C510.1 C511.1 C512.1 C513.1 C514.1 C515.1 C516.1 C517.1 C518.1 C519.1 C520.1 C521.1 C522.1 R502.2 R503.2 U501.A4(VDD2) U501.A9(VDD2) U501.AA3(VDDQ) U501.AA5(VDDQ) U501.AA8(VDDQ) U501.AA10(VDDQ) U501.AB4(VDD2) U501.AB9(VDD2) U501.B3(VDDQ) U501.B5(VDDQ) U501.B8(VDDQ) U501.B10(VDDQ) U501.D1(VDDQ) U501.D5(VDDQ) U501.D8(VDDQ) U501.D12(VDDQ) U501.F3(VDDQ) U501.F5(VDD2) U501.F8(VDD2) U501.F10(VDDQ) U501.G2(ODT_CA_A) U501.H1(VDD2) U501.H5(VDD2) U501.H8(VDD2) U501.H12(VDD2) U501.K1(VDD2) U501.K3(VDD2) U501.K10(VDD2) U501.K12(VDD2) U501.N1(VDD2) U501.N3(VDD2) U501.N10(VDD2) U501.N12(VDD2) U501.R1(VDD2) U501.R5(VDD2) U501.R8(VDD2) U501.R12(VDD2) U501.T2(ODT_CA_B) U501.U3(VDDQ) U501.U5(VDD2) U501.U8(VDD2) U501.U10(VDDQ) U501.W1(VDDQ) U501.W5(VDDQ) U501.W8(VDDQ) U501.W12(VDDQ)
+1.8V_BK7_NVCC: C501.1 C502.1 C503.1 C504.1 C505.1 C506.1 U501.F1(VDD1) U501.F12(VDD1) U501.G4(VDD1) U501.G9(VDD1) U501.T4(VDD1) U501.T9(VDD1) U501.U1(VDD1) U501.U12(VDD1)
GND: C501.2 C502.2 C503.2 C504.2 C505.2 C506.2 C507.2 C508.2 C509.2 C510.2 C511.2 C512.2 C513.2 C514.2 C515.2 C516.2 C517.2 C518.2 C519.2 C520.2 C521.2 C522.2 R501.2 U501.A3(VSS) U501.A10(VSS) U501.AB3(VSS) U501.AB5(VSS) U501.AB8(VSS) U501.AB10(VSS) U501.C1(VSS) U501.C5(VSS) U501.C8(VSS) U501.C12(VSS) U501.D2(VSS) U501.D4(VSS) U501.D9(VSS) U501.D11(VSS) U501.E1(VSS) U501.E5(VSS) U501.E8(VSS) U501.E12(VSS) U501.G1(VSS) U501.G3(VSS) U501.G5(VSS) U501.G8(VSS) U501.G10(VSS) U501.G12(VSS) U501.J1(VSS) U501.J3(VSS) U501.J10(VSS) U501.J12(VSS) U501.K2(VSS) U501.K4(VSS) U501.K9(VSS) U501.K11(VSS) U501.N2(VSS) U501.N4(VSS) U501.N9(VSS) U501.N11(VSS) U501.P1(VSS) U501.P3(VSS) U501.P10(VSS) U501.P12(VSS) U501.T1(VSS) U501.T3(VSS) U501.T5(VSS) U501.T8(VSS) U501.T10(VSS) U501.T12(VSS) U501.V1(VSS) U501.V5(VSS) U501.V8(VSS) U501.V12(VSS) U501.W2(VSS) U501.W4(VSS) U501.W9(VSS) U501.W11(VSS) U501.Y1(VSS) U501.Y5(VSS) U501.Y8(VSS) U501.Y12(VSS)
A_CA0: U501.H2(CA0_A)
A_CA1: U501.J2(CA1_A)
A_CA2: U501.H9(CA2_A)
A_CA3: U501.H10(CA3_A)
A_CA4: U501.H11(CA4_A)
A_CA5: U501.J11(CA5_A)
A_CK_N: U501.J9(CK_c_A) ; port LPDDR4_CHA.CK_N  [project net DRAM_CHB.CK_N]
A_CK_P: U501.J8(CK_t_A) ; port LPDDR4_CHA.CK_P  [project net DRAM_CHB.CK_P]
A_CKE0: U501.J4(CKE0_A) ; port LPDDR4_CHA.CKE0  [project net DRAM_CHB.CKE0]
A_CKE1: U501.J5(CKE1_A) ; port LPDDR4_CHA.CKE1  [project net DRAM_CHB.CKE1]
A_CS0: U501.H4(CS0_A) ; port LPDDR4_CHA.CS0  [project net DRAM_CHB.CS0]
A_CS1: U501.H3(CS1_A) ; port LPDDR4_CHA.CS1  [project net DRAM_CHB.CS1]
A_DMI0: U501.C3(DMI0_A) ; harness LPDDR4_BYTE.DMI
A_DMI1: U501.C10(DMI1_A) ; harness LPDDR4_BYTE.DMI
A_DQ0: U501.B2(DQ0_A)
A_DQ1: U501.C2(DQ1_A)
A_DQ2: U501.E2(DQ2_A)
A_DQ3: U501.F2(DQ3_A)
A_DQ4: U501.F4(DQ4_A)
A_DQ5: U501.E4(DQ5_A)
A_DQ6: U501.C4(DQ6_A)
A_DQ7: U501.B4(DQ7_A)
A_DQ8: U501.B11(DQ8_A)
A_DQ9: U501.C11(DQ9_A)
A_DQ10: U501.E11(DQ10_A)
A_DQ11: U501.F11(DQ11_A)
A_DQ12: U501.F9(DQ12_A)
A_DQ13: U501.E9(DQ13_A)
A_DQ14: U501.C9(DQ14_A)
A_DQ15: U501.B9(DQ15_A)
A_DQS0_N: U501.E3(DQS0_c_A) ; harness LPDDR4_BYTE.DQS_N
A_DQS0_P: U501.D3(DQS0_t_A) ; harness LPDDR4_BYTE.DQS_P
A_DQS1_N: U501.E10(DQS1_c_A) ; harness LPDDR4_BYTE.DQS_N
A_DQS1_P: U501.D10(DQS1_t_A) ; harness LPDDR4_BYTE.DQS_P
B_CA0: U501.R2(CA0_B)
B_CA1: U501.P2(CA1_B)
B_CA2: U501.R9(CA2_B)
B_CA3: U501.R10(CA3_B)
B_CA4: U501.R11(CA4_B)
B_CA5: U501.P11(CA5_B)
B_CK_N: U501.P9(CK_c_B) ; port LPDDR4_CHB.CK_N  [project net DRAM_CHA.CK_N]
B_CK_P: U501.P8(CK_t_B) ; port LPDDR4_CHB.CK_P  [project net DRAM_CHA.CK_P]
B_CKE0: U501.P4(CKE0_B) ; port LPDDR4_CHB.CKE0  [project net DRAM_CHA.CKE0]
B_CKE1: U501.P5(CKE1_B) ; port LPDDR4_CHB.CKE1  [project net DRAM_CHA.CKE1]
B_CS0: U501.R4(CS0_B) ; port LPDDR4_CHB.CS0  [project net DRAM_CHA.CS0]
B_CS1: U501.R3(CS1_B) ; port LPDDR4_CHB.CS1  [project net DRAM_CHA.CS1]
B_DMI0: U501.Y3(DMI0_B) ; harness LPDDR4_BYTE.DMI
B_DMI1: U501.Y10(DMI1_B) ; harness LPDDR4_BYTE.DMI
B_DQ0: U501.AA2(DQ0_B)  [project net A_DQ8]
B_DQ1: U501.Y2(DQ1_B)  [project net A_DQ9]
B_DQ2: U501.V2(DQ2_B)  [project net A_DQ10]
B_DQ3: U501.U2(DQ3_B)  [project net A_DQ11]
B_DQ4: U501.U4(DQ4_B)  [project net A_DQ12]
B_DQ5: U501.V4(DQ5_B)  [project net A_DQ13]
B_DQ6: U501.Y4(DQ6_B)  [project net A_DQ14]
B_DQ7: U501.AA4(DQ7_B)  [project net A_DQ15]
B_DQ8: U501.AA11(DQ8_B)  [project net A_DQ0]
B_DQ9: U501.Y11(DQ9_B)  [project net A_DQ1]
B_DQ10: U501.V11(DQ10_B)  [project net A_DQ2]
B_DQ11: U501.U11(DQ11_B)  [project net A_DQ3]
B_DQ12: U501.U9(DQ12_B)  [project net A_DQ4]
B_DQ13: U501.V9(DQ13_B)  [project net A_DQ5]
B_DQ14: U501.Y9(DQ14_B)  [project net A_DQ6]
B_DQ15: U501.AA9(DQ15_B)  [project net A_DQ7]
B_DQS0_N: U501.V3(DQS0_c_B) ; harness LPDDR4_BYTE.DQS_N
B_DQS0_P: U501.W3(DQS0_t_B) ; harness LPDDR4_BYTE.DQS_P
B_DQS1_N: U501.V10(DQS1_c_B) ; harness LPDDR4_BYTE.DQS_N
B_DQS1_P: U501.W10(DQS1_t_B) ; harness LPDDR4_BYTE.DQS_P
DRAM_RST_B: R501.1 U501.T11(~{RESET}) ; port RESET_B
NetR502_1: R502.1 U501.A8(ZQ1)
NetR503_1: R503.1 U501.A5(ZQ0)

Not connected (* = marked no-connect by the designer): U501 A1(DNU)* A2(DNU)* A11(DNU)* A12(DNU)* AA1(DNU)* AA12(DNU)* AB1(DNU)* AB2(DNU)* AB11(DNU)* AB12(DNU)* B1(DNU)* B12(DNU)* G11(NC)* K5(NC)* K8(NC)* N5(NC)* N8(NC)*

### Buses and harness runs
bus A_CA[0..5]
bus A_DQ[0..7]
bus A_DQ[8..15]
bus B_CA[0..5]
bus B_DQ[0..7]
bus B_DQ[8..15]

### Layout directives
net class S50: A_CA[0..5], A_CK_N, A_CK_P, A_CKE0, A_CKE1, A_CS0, A_CS1, A_DMI0, A_DMI1, A_DQ[0..7], A_DQ[8..15], A_DQS0_N, A_DQS0_P, A_DQS1_N, A_DQS1_P, B_CA[0..5], B_CK_N, B_CK_P, B_CKE0, B_CKE1, B_CS0, B_CS1, B_DMI0, B_DMI1, B_DQ[0..7], B_DQ[8..15], B_DQS0_N, B_DQS0_P, B_DQS1_N, B_DQS1_P
differential pair; differential pair class D85: A_DQS0_N, A_DQS0_P, A_DQS1_N, A_DQS1_P, B_DQS0_N, B_DQS0_P, B_DQS1_N, B_DQS1_P, DRAM_CHA.CK_N, DRAM_CHA.CK_P, DRAM_CHB.CK_N, DRAM_CHB.CK_P

### Notes on the sheet
- (in symbol TITLE_BLOCK) Project; File; Variant; Page; /; Date; Revision; Author; Reviewer

### Library data of the parts
C501 C502 C507 C508 C521 C522 = Capacitors: Capacitor; Component Type: Capacitors
C503-C506 C509-C520 = CMP-03422-000660-2: CAP CER 1UF 6.3V X5R 0201; Manufacturer: Yageo; Tolerance: 0.2; Material: Ceramic; Temperature Coefficient: 15%; Category: Cap; Digikey Description: CAP CER 1UF 6.3V X5R 0201; Temperature: -55°C to +85°C; Temperature Range High: +85°C; ComponentLink2Description: Datasheet; Lead Free: Yes; Height: 0.33mm; Temperature Range Low: -55°C; Temperature Characteristic: X5R; Device Class L1: Passive Components; Footprint Url: http://www.yageo.com/exep/pages/download/literatures/UPY-C_GEN_24.pdf; Value: 1 uF; Octopart: https://octopart.com/cc0201mrx5r5bb105-yageo-33242268; Manufacturer Part Number: CC0201MRX5R5BB105; Automotive: No; Mouser Description: Multilayer Ceramic Capacitors MLCC - SMD/SMT 1.0uF 6.3V X5R 20%; Device Class L3: Ceramic Capacitors; ComponentLink2URL: http://www.yageo.com/documents/recent/UPY-GPHC_X5R_4V-to-50V_25.pdf; RoHS: TRUE; Ipc Land Pattern Name: CAPC6030X30; Device Class L2: Capacitors
R501 = Resistors: Resistor; Component Type: Resistors
R502 R503 = CMP-26527-006303-1: 240Ω ±1% 0.05W 0201 Thick Film Chip Resistor AEC-Q200 compliant; Temperature Coefficient: 200ppm/°C; Max Power Dissipation: 50mW; Resistor Type: Thick Film; Case Code (Imperial): 0201; Case Code (Metric): 0603; Min Operating Temperature: -55°C; Length: 0.024inch; Packaging: Tape and Reel; Max Operating Temperature: 125°C; Number of Terminations: 2; Width: 0.012inch; Height: 0.009inch
U501 = CMP-14959-000001-1: IC DRAM LPDDR4 32G FBGA; Manufacturer: Micron; Frequency: 2133MHz; Min Supply Voltage: 0.57V; Standoff Height: 0.177mm; Memory Type: SDRAM; Max Supply Voltage: 1.95V; Automotive Grade: Grade 3; Memory Size: 32Gbits; Device Class L1: Integrated Circuits (ICs); ComponentLink2Description: Datasheet; Temperature Range High: +85°C; Manufacturer Part Number: MT53D1024M32D4DT-046 WT:D; Automotive: Yes; Package: DT; Temperature Range Low: -30°C; Ipc Land Pattern Name: BGA264N65P12X22_1450X1000X85; Category: IC; ComponentLink2URL: https://www.micron.com/products/dram/lpdram/part-catalog/mt53d1024m32d4dt-046-wt; Device Class L3: RAM; Octopart: https://octopart.com/mt53d1024m32d4dt-046+wt%3Ad-micron-92400194; Height: 0.95mm; RoHS: TRUE; Temperature: -30°C to +85°C; Digikey Description: IC DRAM LPDDR4 32G FBGA; Device Class L2: Memory; Lead Free: Yes
TB?#6 = TITLE_BLOCK: Review Date: *

## Sheet 06 ethernet.SchDoc
size A3; SheetNumber: 10; SheetTotal: 16
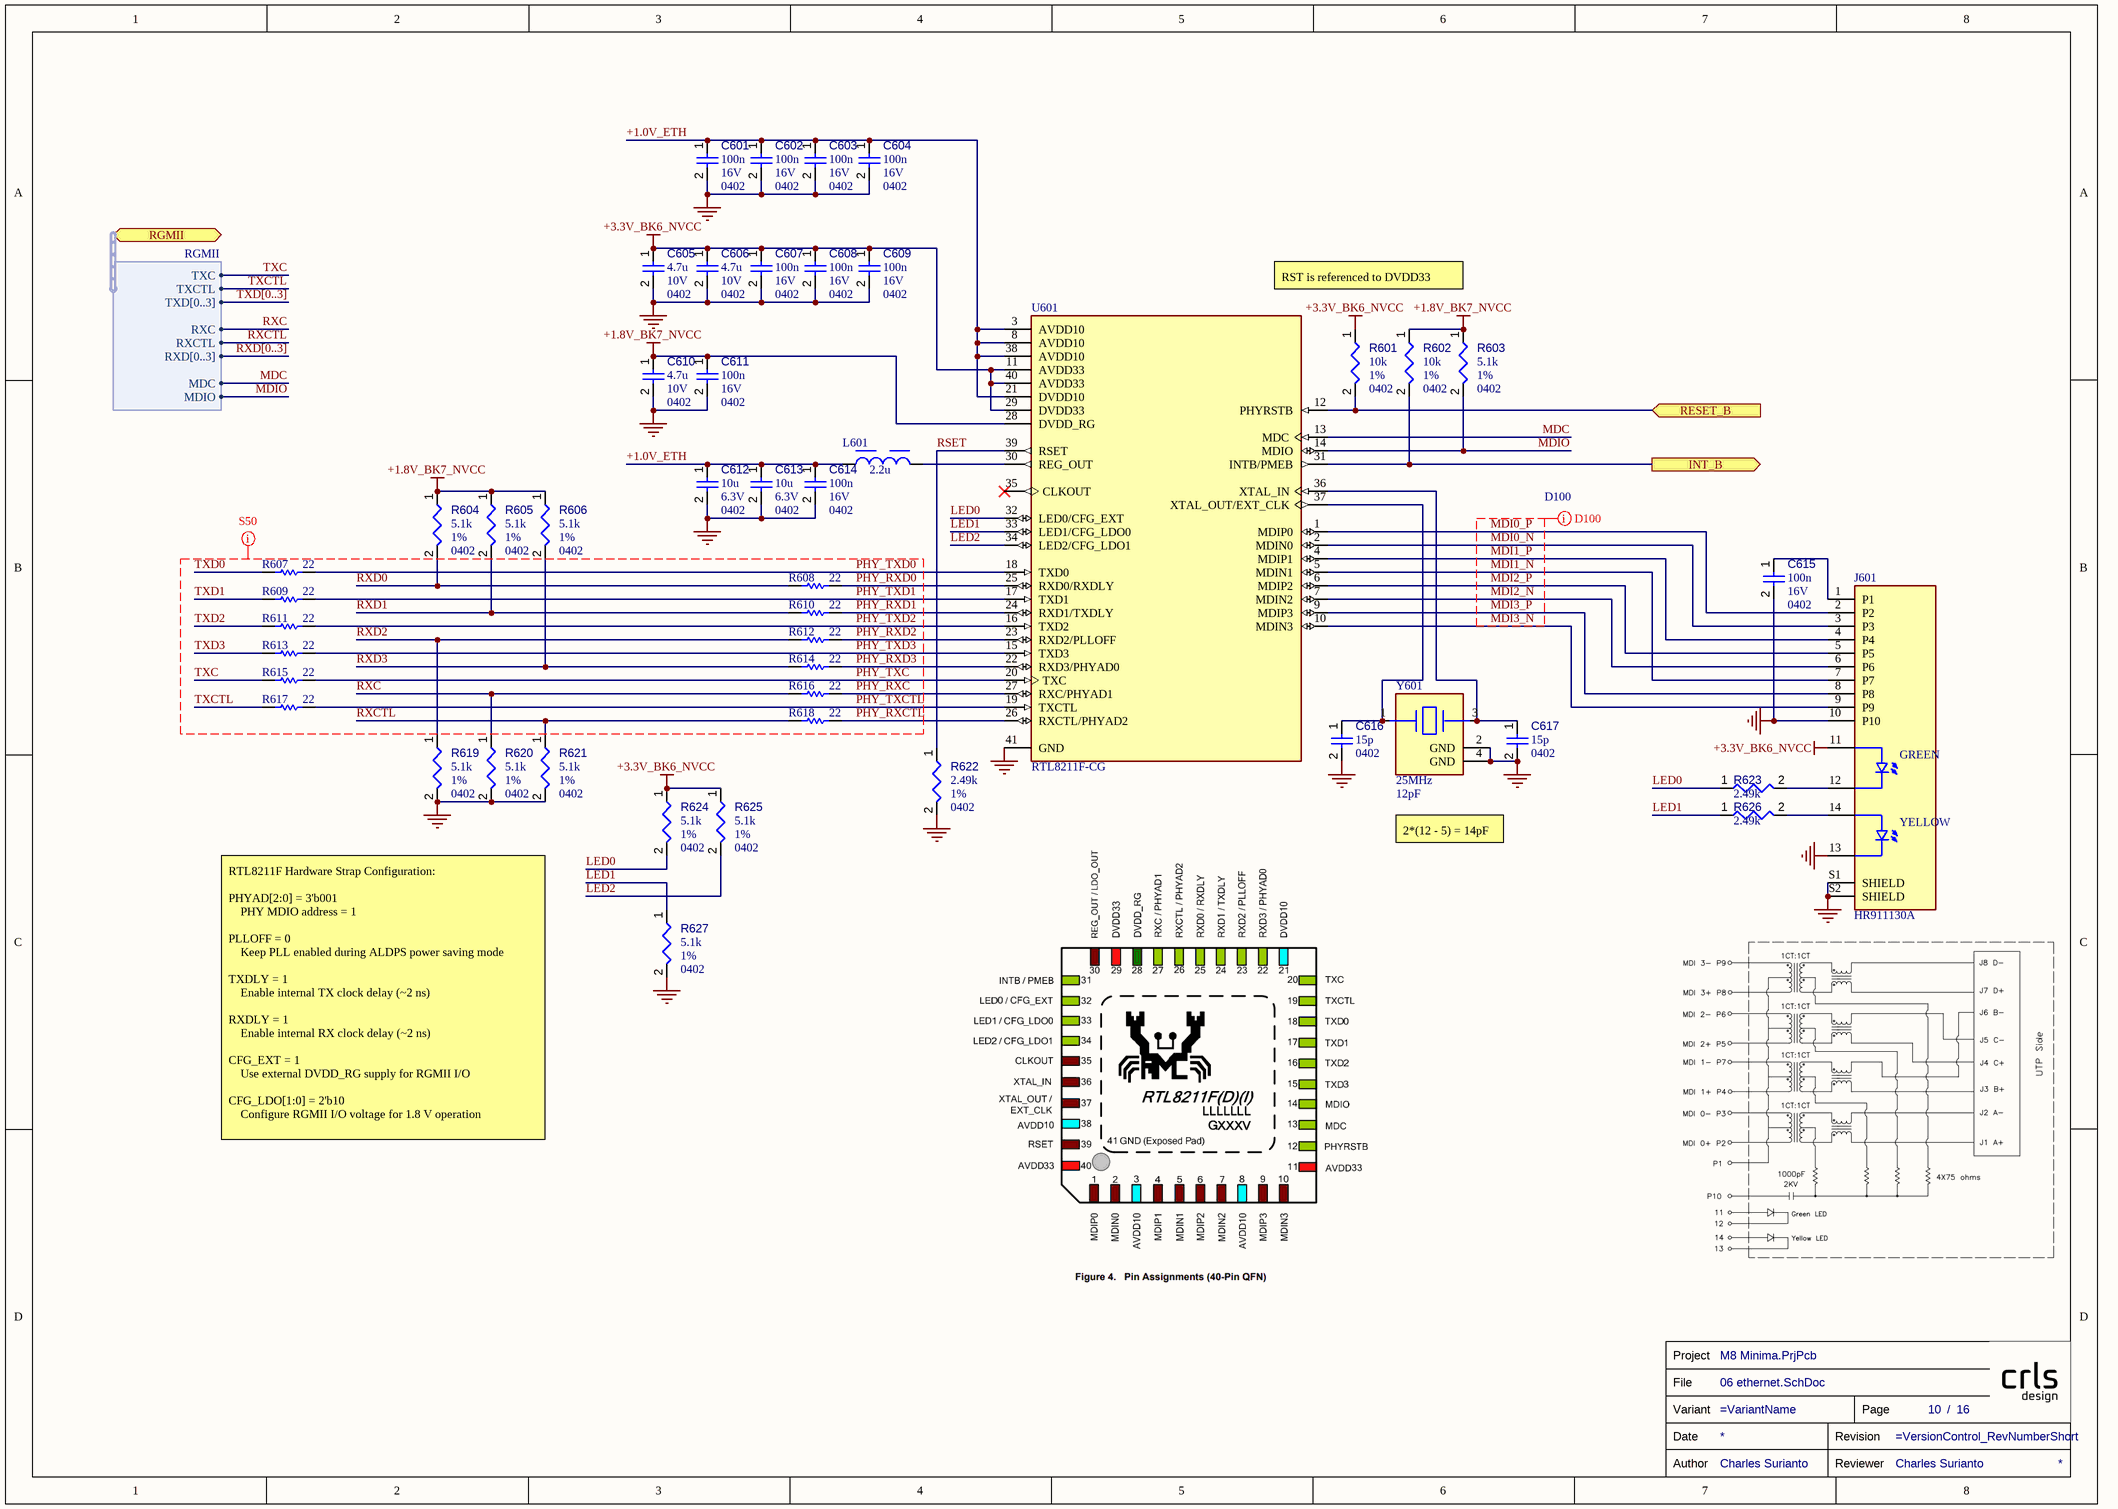
[diagram p7: 06 ethernet.SchDoc]

### Parts
(Parts that share a designator on the sheet are numbered #1, #2 ... from top to bottom, then left to right.)
C601  value 100n  Case/Package: 0402  Voltage Rating: 16V  [CAPC0402(1005)60_L]  (hidden comment: Capacitors,0402,100n,16V)
C602  value 100n  Case/Package: 0402  Voltage Rating: 16V  [CAPC0402(1005)60_L]  (hidden comment: Capacitors,0402,100n,16V)
C603  value 100n  Case/Package: 0402  Voltage Rating: 16V  [CAPC0402(1005)60_L]  (hidden comment: Capacitors,0402,100n,16V)
C604  value 100n  Case/Package: 0402  Voltage Rating: 16V  [CAPC0402(1005)60_L]  (hidden comment: Capacitors,0402,100n,16V)
C605  value 4.7u  Case/Package: 0402  Voltage Rating: 10V  [CAPC0402(1005)60_L]  (hidden comment: Capacitors,0402,4.7u,10V)
C606  value 4.7u  Case/Package: 0402  Voltage Rating: 10V  [CAPC0402(1005)60_L]  (hidden comment: Capacitors,0402,4.7u,10V)
C607  value 100n  Case/Package: 0402  Voltage Rating: 16V  [CAPC0402(1005)60_L]  (hidden comment: Capacitors,0402,100n,16V)
C608  value 100n  Case/Package: 0402  Voltage Rating: 16V  [CAPC0402(1005)60_L]  (hidden comment: Capacitors,0402,100n,16V)
C609  value 100n  Case/Package: 0402  Voltage Rating: 16V  [CAPC0402(1005)60_L]  (hidden comment: Capacitors,0402,100n,16V)
C610  value 4.7u  Case/Package: 0402  Voltage Rating: 10V  [CAPC0402(1005)60_L]  (hidden comment: Capacitors,0402,4.7u,10V)
C611  value 100n  Case/Package: 0402  Voltage Rating: 16V  [CAPC0402(1005)60_L]  (hidden comment: Capacitors,0402,100n,16V)
C612  value 10u  Case/Package: 0402  Voltage Rating: 6.3V  [CAPC0402(1005)60_L]  (hidden comment: Capacitors,0402,10u,6.3V)
C613  value 10u  Case/Package: 0402  Voltage Rating: 6.3V  [CAPC0402(1005)60_L]  (hidden comment: Capacitors,0402,10u,6.3V)
C614  value 100n  Case/Package: 0402  Voltage Rating: 16V  [CAPC0402(1005)60_L]  (hidden comment: Capacitors,0402,100n,16V)
C615  value 100n  Case/Package: 0402  Voltage Rating: 16V  [CAPC0402(1005)60_L]  (hidden comment: Capacitors,0402,100n,16V)
C616  value 15p  Case/Package: 0402  [CAPC0402(1005)60_L]  (hidden comment: Capacitors,0402,15p)
C617  value 15p  Case/Package: 0402  [CAPC0402(1005)60_L]  (hidden comment: Capacitors,0402,15p)
J601  HR911130A  [HANRUN_HR911130A]
L601  Inductance: 2.2u  [WE-LQS_3015]  (hidden comment: 74404032022)
R601  value 10k  Case/Package: 0402  Tolerance: 1%  [RESC0402(1005)_L]  (hidden comment: Resistors,0402,1%,10k)
R602  value 10k  Case/Package: 0402  Tolerance: 1%  [RESC0402(1005)_L]  (hidden comment: Resistors,0402,1%,10k)
R603  value 5.1k  Case/Package: 0402  Tolerance: 1%  [RESC0402(1005)_L]  (hidden comment: Resistors,0402,1%,5.1k)
R604  value 5.1k  Case/Package: 0402  Tolerance: 1%  [RESC0402(1005)_L]  (hidden comment: Resistors,0402,1%,5.1k)
R605  value 5.1k  Case/Package: 0402  Tolerance: 1%  [RESC0402(1005)_L]  (hidden comment: Resistors,0402,1%,5.1k)
R606  value 5.1k  Case/Package: 0402  Tolerance: 1%  [RESC0402(1005)_L]  (hidden comment: Resistors,0402,1%,5.1k)
R607  value 22  [RESC0201(0603)_L]  (hidden comment: 22R 1% 0201(0603))
R608  value 22  [RESC0201(0603)_L]  (hidden comment: 22R 1% 0201(0603))
R609  value 22  [RESC0201(0603)_L]  (hidden comment: 22R 1% 0201(0603))
R610  value 22  [RESC0201(0603)_L]  (hidden comment: 22R 1% 0201(0603))
R611  value 22  [RESC0201(0603)_L]  (hidden comment: 22R 1% 0201(0603))
R612  value 22  [RESC0201(0603)_L]  (hidden comment: 22R 1% 0201(0603))
R613  value 22  [RESC0201(0603)_L]  (hidden comment: 22R 1% 0201(0603))
R614  value 22  [RESC0201(0603)_L]  (hidden comment: 22R 1% 0201(0603))
R615  value 22  [RESC0201(0603)_L]  (hidden comment: 22R 1% 0201(0603))
R616  value 22  [RESC0201(0603)_L]  (hidden comment: 22R 1% 0201(0603))
R617  value 22  [RESC0201(0603)_L]  (hidden comment: 22R 1% 0201(0603))
R618  value 22  [RESC0201(0603)_L]  (hidden comment: 22R 1% 0201(0603))
R619  value 5.1k  Case/Package: 0402  Tolerance: 1%  [RESC0402(1005)_L]  (hidden comment: Resistors,0402,1%,5.1k)
R620  value 5.1k  Case/Package: 0402  Tolerance: 1%  [RESC0402(1005)_L]  (hidden comment: Resistors,0402,1%,5.1k)
R621  value 5.1k  Case/Package: 0402  Tolerance: 1%  [RESC0402(1005)_L]  (hidden comment: Resistors,0402,1%,5.1k)
R622  value 2.49k  Case/Package: 0402  Tolerance: 1%  [RESC0402(1005)_L]  (hidden comment: Resistors,0402,1%,2.49k)
R623  value 2.49k  [RESC0402(1005)_L]  (hidden comment: Resistors,0402,1%,2.49k)
R624  value 5.1k  Case/Package: 0402  Tolerance: 1%  [RESC0402(1005)_L]  (hidden comment: Resistors,0402,1%,5.1k)
R625  value 5.1k  Case/Package: 0402  Tolerance: 1%  [RESC0402(1005)_L]  (hidden comment: Resistors,0402,1%,5.1k)
R626  value 2.49k  [RESC0402(1005)_L]  (hidden comment: Resistors,0402,1%,2.49k)
R627  value 5.1k  Case/Package: 0402  Tolerance: 1%  [RESC0402(1005)_L]  (hidden comment: Resistors,0402,1%,5.1k)
TB?#7  Reviewer: Charles Surianto  (hidden comment: TITLE_BLOCK)  (graphical)
U601  RTL8211F-CG  [QFN40P500X500X90-41N]
Y601  Frequency: 25MHz  Load Capacitance: 12pF  [FP-TSX-3225-MFG]  (hidden comment: TSX-3225 25.0000MF10P-C0)

### Ports
INT_B (out), RESET_B (in), RGMII (bidir, harness RGMII)

### Harnesses
RGMII: TXC, TXCTL, TXD[0..3], RXC, RXCTL, RXD[0..3], MDIO, MDC

### Nets
+1.8V_BK7_NVCC: C610.1 C611.1 R602.1 R603.1 R604.1 R605.1 R606.1 U601.28(DVDD_RG)
+3.3V_BK6_NVCC: C605.1 C606.1 C607.1 C608.1 C609.1 J601.11 R601.1 R624.1 R625.1 U601.11(AVDD33) U601.29(DVDD33) U601.40(AVDD33)
GND: C601.2 C602.2 C603.2 C604.2 C605.2 C606.2 C607.2 C608.2 C609.2 C610.2 C611.2 C612.2 C613.2 C614.2 C615.2 C616.2 C617.2 J601.10(P10) J601.13 J601.S1(SHIELD) J601.S2(SHIELD) R619.2 R620.2 R621.2 R622.2 R627.2 U601.41(GND) Y601.2(GND) Y601.4(GND)
+1.0V_ETH: C601.1 C602.1 C603.1 C604.1 C612.1 C613.1 C614.1 L601.1 U601.3(AVDD10) U601.8(AVDD10) U601.21(DVDD10) U601.38(AVDD10)
ENET_INT_B: R602.2 U601.31(INTB/PMEB) ; port INT_B
ENET_RST_B: R601.2 U601.12(PHYRSTB) ; port RESET_B
LED0: R623.1 R624.2 U601.32(LED0/CFG_EXT)
LED1: R626.1 R627.1 U601.33(LED1/CFG_LDO0)
LED2: R625.2 U601.34(LED2/CFG_LDO1)
MDC: U601.13(MDC) ; port RGMII.MDC  [project net RGMII.MDC]
MDI0_N: J601.3(P3) U601.2(MDIN0)
MDI0_P: J601.2(P2) U601.1(MDIP0)
MDI1_N: J601.7(P7) U601.5(MDIN1)
MDI1_P: J601.4(P4) U601.4(MDIP1)
MDI2_N: J601.6(P6) U601.7(MDIN2)
MDI2_P: J601.5(P5) U601.6(MDIP2)
MDI3_N: J601.9(P9) U601.10(MDIN3)
MDI3_P: J601.8(P8) U601.9(MDIP3)
MDIO: R603.2 U601.14(MDIO) ; port RGMII.MDIO  [project net RGMII.MDIO]
PHY_RXC: R616.2 U601.27(RXC/PHYAD1)
PHY_RXCTL: R618.2 U601.26(RXCTL/PHYAD2)
PHY_RXD0: R608.2 U601.25(RXD0/RXDLY)
PHY_RXD1: R610.2 U601.24(RXD1/TXDLY)
PHY_RXD2: R612.2 U601.23(RXD2/PLLOFF)
PHY_RXD3: R614.2 U601.22(RXD3/PHYAD0)
PHY_TXC: R615.2 U601.20(TXC)
PHY_TXCTL: R617.2 U601.19(TXCTL)
PHY_TXD0: R607.2 U601.18(TXD0)
PHY_TXD1: R609.2 U601.17(TXD1)
PHY_TXD2: R611.2 U601.16(TXD2)
PHY_TXD3: R613.2 U601.15(TXD3)
RSET: R622.1 U601.39(RSET)
RXC: R616.1 R620.1 ; port RGMII.RXC  [project net RGMII.RXC]
RXCTL: R618.1 R621.1 ; port RGMII.RXCTL  [project net RGMII.RXCTL]
RXD0: R604.2 R608.1  [project net ENET_RD0]
RXD1: R605.2 R610.1  [project net ENET_RD1]
RXD2: R612.1 R619.1  [project net ENET_RD2]
RXD3: R606.2 R614.1  [project net ENET_RD3]
TXC: R615.1 ; port RGMII.TXC  [project net RGMII.TXC]
TXCTL: R617.1 ; port RGMII.TXCTL  [project net RGMII.TXCTL]
TXD0: R607.1  [project net ENET_TD0]
TXD1: R609.1  [project net ENET_TD1]
TXD2: R611.1  [project net ENET_TD2]
TXD3: R613.1  [project net ENET_TD3]
NetC615_1: C615.1 J601.1(P1)
NetC616_1: C616.1 U601.37(XTAL_OUT/EXT_CLK) Y601.1
NetC617_1: C617.1 U601.36(XTAL_IN) Y601.3
NetJ601_12: J601.12 R623.2
NetJ601_14: J601.14 R626.2
NetL601_2: L601.2 U601.30(REG_OUT)

Not connected (* = marked no-connect by the designer): U601 35(CLKOUT)*

### Buses and harness runs
bus RXD[0..3]
bus TXD[0..3]

### Layout directives
differential pair; differential pair class D100: MDI0_N, MDI0_P, MDI1_N, MDI1_P, MDI2_N, MDI2_P, MDI3_N, MDI3_P
net class S50: PHY_RXC, PHY_RXCTL, PHY_RXD0, PHY_RXD1, PHY_RXD2, PHY_RXD3, PHY_TXC, PHY_TXCTL, PHY_TXD0, PHY_TXD1, PHY_TXD2, PHY_TXD3, RXC, RXCTL, RXD0, RXD1, RXD2, RXD3, TXC, TXCTL, TXD0, TXD1, TXD2, TXD3

### Notes on the sheet
- RST is referenced to DVDD33
- 2*(12 - 5) = 14pF
- RTL8211F Hardware Strap Configuration:
  PHYAD[2:0] = 3'b001
  PHY MDIO address = 1
  PLLOFF = 0
  Keep PLL enabled during ALDPS power saving mode
  TXDLY = 1
  Enable internal TX clock delay (~2 ns)
  RXDLY = 1
  Enable internal RX clock delay (~2 ns)
  CFG_EXT = 1
  Use external DVDD_RG supply for RGMII I/O
  CFG_LDO[1:0] = 2'b10
  Configure RGMII I/O voltage for 1.8 V operation
- (in symbol HR911130A) GREEN; YELLOW
- (in symbol TITLE_BLOCK) Project; File; Variant; Page; /; Date; Revision; Author; Reviewer

### Library data of the parts
C601-C617 = Capacitors: Capacitor; Component Type: Capacitors
J601 = HR911130A: MF: hanrun; SnapEDA_Link: https://www.snapeda.com/parts/HR911130A/HanRun/view-part/?ref=snap; Package: None; Value: *; MP: HR911130A; Check_prices: https://www.snapeda.com/parts/HR911130A/HanRun/view-part/?ref=eda
L601 = CMP-1354-00022-3: Fixed Ind 2.2UH 1.8A 50 Mohm SMD; Self Resonant Frequency: 75MHz; Core Material: Ferrite; Test Frequency: 100kHz; Shielding: Shielded; Saturation Current: 1.7A; DC Resistance (DCR): 50mΩ; Inductance Tolerance: 20%; Max Operating Temperature: 125°C; Case/Package: Nonstandard; Ambient Temperature Range High: 85°C; Termination: SMD/SMT; RoHS: Compliant; Height - Seated (Max): 1.4986mm; REACH SVHC: Unknown; Mount: Surface Mount; Composition: Wirewound; Length: 3mm; Max DC Current: 1.8A; Current Rating: 1.8A; Width: 3mm; Height: 1.5mm; RMS Current (Irms): 1.8A; Ambient Temperature Range Low: -40°C; Tolerance: 20%; Min Operating Temperature: -40°C
R601-R606 R619-R627 = Resistors: Resistor; Component Type: Resistors
  R623 R626: Case/Package: 0402; Tolerance: 1%
R607-R618 = CMP-1010-00226-1: 22R 0.05W 1% 0201 (0603 Metric)  SMD; Case-EIA: 0201; Case-Metric: 0603; Technology: SMT; Power: 0.05 W; Tolerance: 1 %
U601 = RTL8211F-CG: GbE PHY with RGMIII interface & EEE feature (Switch Regulator), QFN40; MF: Realtek Semiconductor Corp; SnapEDA_Link: https://www.snapeda.com/parts/RTL8211F-CG/Realtek/view-part/?ref=snap; Package: None; Value: *; MP: RTL8211F-CG; Check_prices: https://www.snapeda.com/parts/RTL8211F-CG/Realtek/view-part/?ref=eda
Y601 = CMP-36405-000019-1: CRYSTAL 25.0000MHZ 18PF SMD; ESR (Equivalent Series Resistance): 40R; Frequency Stability: 10ppm; Max Operating Temperature: 85°C; Length: 3.2mm; Packaging: Tape and Reel; Min Operating Temperature: -20°C; Depth: 2.5mm; Case/Package: SMD/SMT; Number of Pins: 4
TB?#7 = TITLE_BLOCK: Review Date: *

## Sheet 07 flash.SchDoc
size A3; SheetNumber: 11; SheetTotal: 16
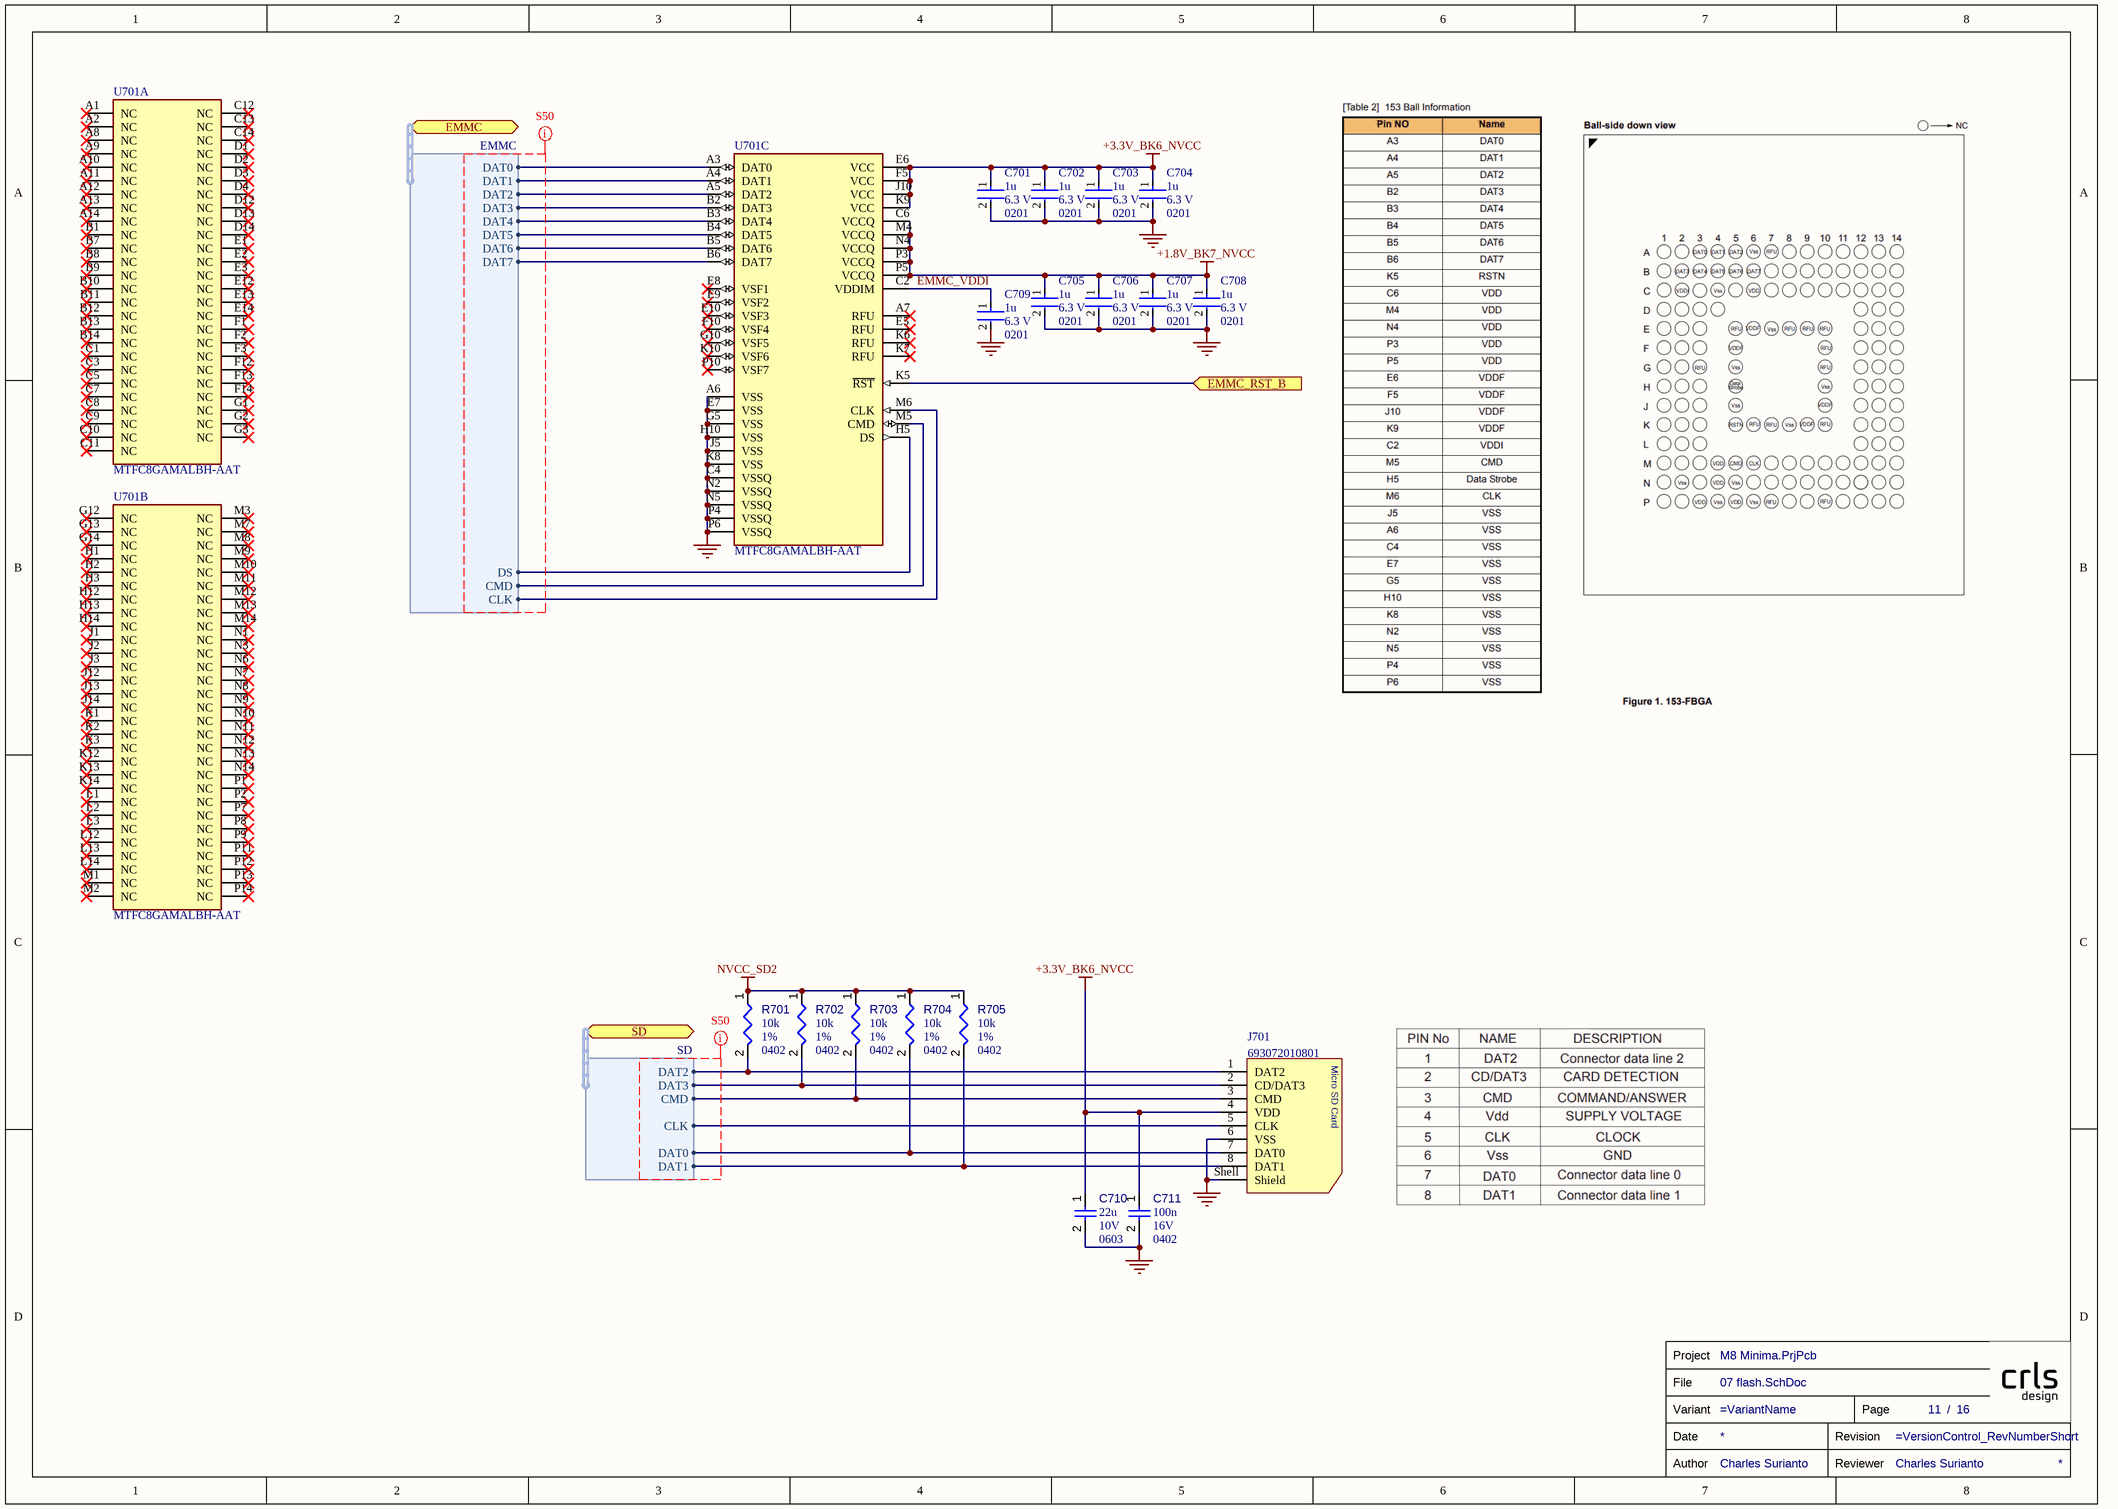
[diagram p8: 07 flash.SchDoc]

### Parts
(Parts that share a designator on the sheet are numbered #1, #2 ... from top to bottom, then left to right.)
C701  Package: 0201  Capacitance: 1u  Voltage Rating: 6.3 V  [FP-CC0201-BA-MFG]  (hidden comment: CC0201MRX5R5BB105)
C702  Package: 0201  Capacitance: 1u  Voltage Rating: 6.3 V  [FP-CC0201-BA-MFG]  (hidden comment: CC0201MRX5R5BB105)
C703  Package: 0201  Capacitance: 1u  Voltage Rating: 6.3 V  [FP-CC0201-BA-MFG]  (hidden comment: CC0201MRX5R5BB105)
C704  Package: 0201  Capacitance: 1u  Voltage Rating: 6.3 V  [FP-CC0201-BA-MFG]  (hidden comment: CC0201MRX5R5BB105)
C705  Package: 0201  Capacitance: 1u  Voltage Rating: 6.3 V  [FP-CC0201-BA-MFG]  (hidden comment: CC0201MRX5R5BB105)
C706  Package: 0201  Capacitance: 1u  Voltage Rating: 6.3 V  [FP-CC0201-BA-MFG]  (hidden comment: CC0201MRX5R5BB105)
C707  Package: 0201  Capacitance: 1u  Voltage Rating: 6.3 V  [FP-CC0201-BA-MFG]  (hidden comment: CC0201MRX5R5BB105)
C708  Package: 0201  Capacitance: 1u  Voltage Rating: 6.3 V  [FP-CC0201-BA-MFG]  (hidden comment: CC0201MRX5R5BB105)
C709  Package: 0201  Capacitance: 1u  Voltage Rating: 6.3 V  [FP-CC0201-BA-MFG]  (hidden comment: CC0201MRX5R5BB105)
C710  value 22u  Case/Package: 0603  Voltage Rating: 10V  [CAPC0603(1608)100_L]  (hidden comment: Capacitors,0603,22u,10V)
C711  value 100n  Case/Package: 0402  Voltage Rating: 16V  [CAPC0402(1005)60_L]  (hidden comment: Capacitors,0402,100n,16V)
J701  693072010801  [693072010801]
R701  value 10k  Case/Package: 0402  Tolerance: 1%  [RESC0402(1005)_L]  (hidden comment: Resistors,0402,1%,10k)
R702  value 10k  Case/Package: 0402  Tolerance: 1%  [RESC0402(1005)_L]  (hidden comment: Resistors,0402,1%,10k)
R703  value 10k  Case/Package: 0402  Tolerance: 1%  [RESC0402(1005)_L]  (hidden comment: Resistors,0402,1%,10k)
R704  value 10k  Case/Package: 0402  Tolerance: 1%  [RESC0402(1005)_L]  (hidden comment: Resistors,0402,1%,10k)
R705  value 10k  Case/Package: 0402  Tolerance: 1%  [RESC0402(1005)_L]  (hidden comment: Resistors,0402,1%,10k)
TB?#8  Reviewer: Charles Surianto  (hidden comment: TITLE_BLOCK)  (graphical)
U701  MTFC8GAMALBH-AAT  [FP-BH-MFG]  (parts A,B,C of 3)

### Ports
EMMC (bidir, harness EMMC), EMMC_RST_B (in), SD (bidir, harness SD)

### Harnesses
SD: DAT2, DAT3, CMD, DAT1, DAT0, CLK
EMMC: DAT1, DAT3, DAT2, DAT4, DAT0, DAT5, DAT6, DAT7, DS, CMD, CLK

### Nets
+1.8V_BK7_NVCC: C705.1 C706.1 C707.1 C708.1 U701.C6(VCCQ) U701.M4(VCCQ) U701.N4(VCCQ) U701.P3(VCCQ) U701.P5(VCCQ)
+3.3V_BK6_NVCC: C701.1 C702.1 C703.1 C704.1 C710.1 C711.1 J701.4(VDD) U701.E6(VCC) U701.F5(VCC) U701.J10(VCC) U701.K9(VCC)
GND: C701.2 C702.2 C703.2 C704.2 C705.2 C706.2 C707.2 C708.2 C709.2 C710.2 C711.2 J701.6(VSS) J701.Shell(Shield) U701.A6(VSS) U701.C4(VSSQ) U701.E7(VSS) U701.G5(VSS) U701.H10(VSS) U701.J5(VSS) U701.K8(VSS) U701.N2(VSSQ) U701.N5(VSSQ) U701.P4(VSSQ) U701.P6(VSSQ)
NVCC_SD2: R701.1 R702.1 R703.1 R704.1 R705.1
EMMC.CLK: U701.M6(CLK) ; port EMMC.CLK
EMMC.CMD: U701.M5(CMD) ; port EMMC.CMD
EMMC.DAT0: U701.A3(DAT0) ; port EMMC.DAT0
EMMC.DAT1: U701.A4(DAT1) ; port EMMC.DAT1
EMMC.DAT2: U701.A5(DAT2) ; port EMMC.DAT2
EMMC.DAT3: U701.B2(DAT3) ; port EMMC.DAT3
EMMC.DAT4: U701.B3(DAT4) ; port EMMC.DAT4
EMMC.DAT5: U701.B4(DAT5) ; port EMMC.DAT5
EMMC.DAT6: U701.B5(DAT6) ; port EMMC.DAT6
EMMC.DAT7: U701.B6(DAT7) ; port EMMC.DAT7
EMMC.DS: U701.H5(DS) ; port EMMC.DS
EMMC_VDDI: C709.1 U701.C2(VDDIM)
SD1_RST_B: U701.K5(~{RST}) ; port EMMC_RST_B
SD.CLK: J701.5(CLK) ; port SD.CLK
SD.CMD: J701.3(CMD) R703.2 ; port SD.CMD
SD.DAT0: J701.7(DAT0) R704.2 ; port SD.DAT0
SD.DAT1: J701.8(DAT1) R705.2 ; port SD.DAT1
SD.DAT2: J701.1(DAT2) R701.2 ; port SD.DAT2
SD.DAT3: J701.2(CD/DAT3) R702.2 ; port SD.DAT3

Not connected (* = marked no-connect by the designer): U701 A1(NC)* A2(NC)* A7(RFU)* A8(NC)* A9(NC)* A10(NC)* A11(NC)* A12(NC)* A13(NC)* A14(NC)* B1(NC)* B7(NC)* B8(NC)* B9(NC)* B10(NC)* B11(NC)* B12(NC)* B13(NC)* B14(NC)* C1(NC)* C3(NC)* C5(NC)* C7(NC)* C8(NC)* C9(NC)* C10(NC)* C11(NC)* C12(NC)* C13(NC)* C14(NC)* D1(NC)* D2(NC)* D3(NC)* D4(NC)* D12(NC)* D13(NC)* D14(NC)* E1(NC)* E2(NC)* E3(NC)* E5(RFU)* E8(VSF1)* E9(VSF2)* E10(VSF3)* E12(NC)* E13(NC)* E14(NC)* F1(NC)* F2(NC)* F3(NC)* F10(VSF4)* F12(NC)* F13(NC)* F14(NC)* G1(NC)* G2(NC)* G3(NC)* G10(VSF5)* G12(NC)* G13(NC)* G14(NC)* H1(NC)* H2(NC)* H3(NC)* H12(NC)* H13(NC)* H14(NC)* J1(NC)* J2(NC)* J3(NC)* J12(NC)* J13(NC)* J14(NC)* K1(NC)* K2(NC)* K3(NC)* K6(RFU)* K7(RFU)* K10(VSF6)* K12(NC)* K13(NC)* K14(NC)* L1(NC)* L2(NC)* L3(NC)* L12(NC)* L13(NC)* L14(NC)* M1(NC)* M2(NC)* M3(NC)* M7(NC)* M8(NC)* M9(NC)* M10(NC)* M11(NC)* M12(NC)* M13(NC)* M14(NC)* N1(NC)* N3(NC)* N6(NC)* N7(NC)* N8(NC)* N9(NC)* N10(NC)* N11(NC)* N12(NC)* N13(NC)* N14(NC)* P1(NC)* P2(NC)* P7(NC)* P8(NC)* P9(NC)* P10(VSF7)* P11(NC)* P12(NC)* P13(NC)* P14(NC)*

### Layout directives
net class S50: (no net found under the mark)

### Notes on the sheet
- (in symbol CMP-1502-00164-3) Micro SD Card
- (in symbol TITLE_BLOCK) Project; File; Variant; Page; /; Date; Revision; Author; Reviewer

### Library data of the parts
C701-C709 = CMP-03422-000660-2: as C503-C506 on sheet 05 lpddr4 ram; Category: Cap; Digikey Description: CAP CER 1UF 6.3V X5R 0201; Temperature: -55°C to +85°C; Temperature Range High: +85°C; ComponentLink2Description: Datasheet; Lead Free: Yes; Height: 0.33mm; Temperature Range Low: -55°C; Temperature Characteristic: X5R; Device Class L1: Passive Components; Footprint Url: http://www.yageo.com/exep/pages/download/literatures/UPY-C_GEN_24.pdf; Value: 1 uF; Octopart: https://octopart.com/cc0201mrx5r5bb105-yageo-33242268; Manufacturer Part Number: CC0201MRX5R5BB105; Automotive: No; Mouser Description: Multilayer Ceramic Capacitors MLCC - SMD/SMT 1.0uF 6.3V X5R 20%; Device Class L3: Ceramic Capacitors; ComponentLink2URL: http://www.yageo.com/documents/recent/UPY-GPHC_X5R_4V-to-50V_25.pdf; RoHS: TRUE; Ipc Land Pattern Name: CAPC6030X30; Device Class L2: Capacitors
C710 C711 = Capacitors: Capacitor; Component Type: Capacitors
J701 = CMP-1502-00164-3: Conn, Memory Skt, Microsd, 8POS, Hinged Rohs Compliant: Yes; Insulation Resistance: 1GΩ; Connector Type: Connector; Memory Type: FLASH; Number of Contacts: 8; Voltage Rating: 100V; Current Rating: 500mA; Contact Material: Gold; Min Operating Temperature: -25°C; Number of Pins: 8; Contact Plating: Gold; REACH SVHC: Unknown; RoHS: Compliant; Color: Black; Number of Positions: 8; Mount: Surface Mount; Length: 14.5mm; Height: 1.95mm; Packaging: Tape and Reel; Max Operating Temperature: 85°C; Width: 13.5mm; Operating Supply Voltage: 100V
R701-R705 = Resistors: Resistor; Component Type: Resistors
U701 = CMP-14955-000001-1: IC FLASH 64GBIT MMC 153TFBGA; Memory Type: Non-Volatile; Memory Size: 64Gb; Max Operating Temperature: 105°C; Min Operating Temperature: -40°C
TB?#8 = TITLE_BLOCK: Review Date: *